# EAGLE design Control HAT v0.2B (EAGLE 9.3.1)

## Sheet 1 of 4: ATmega2560 and Headers
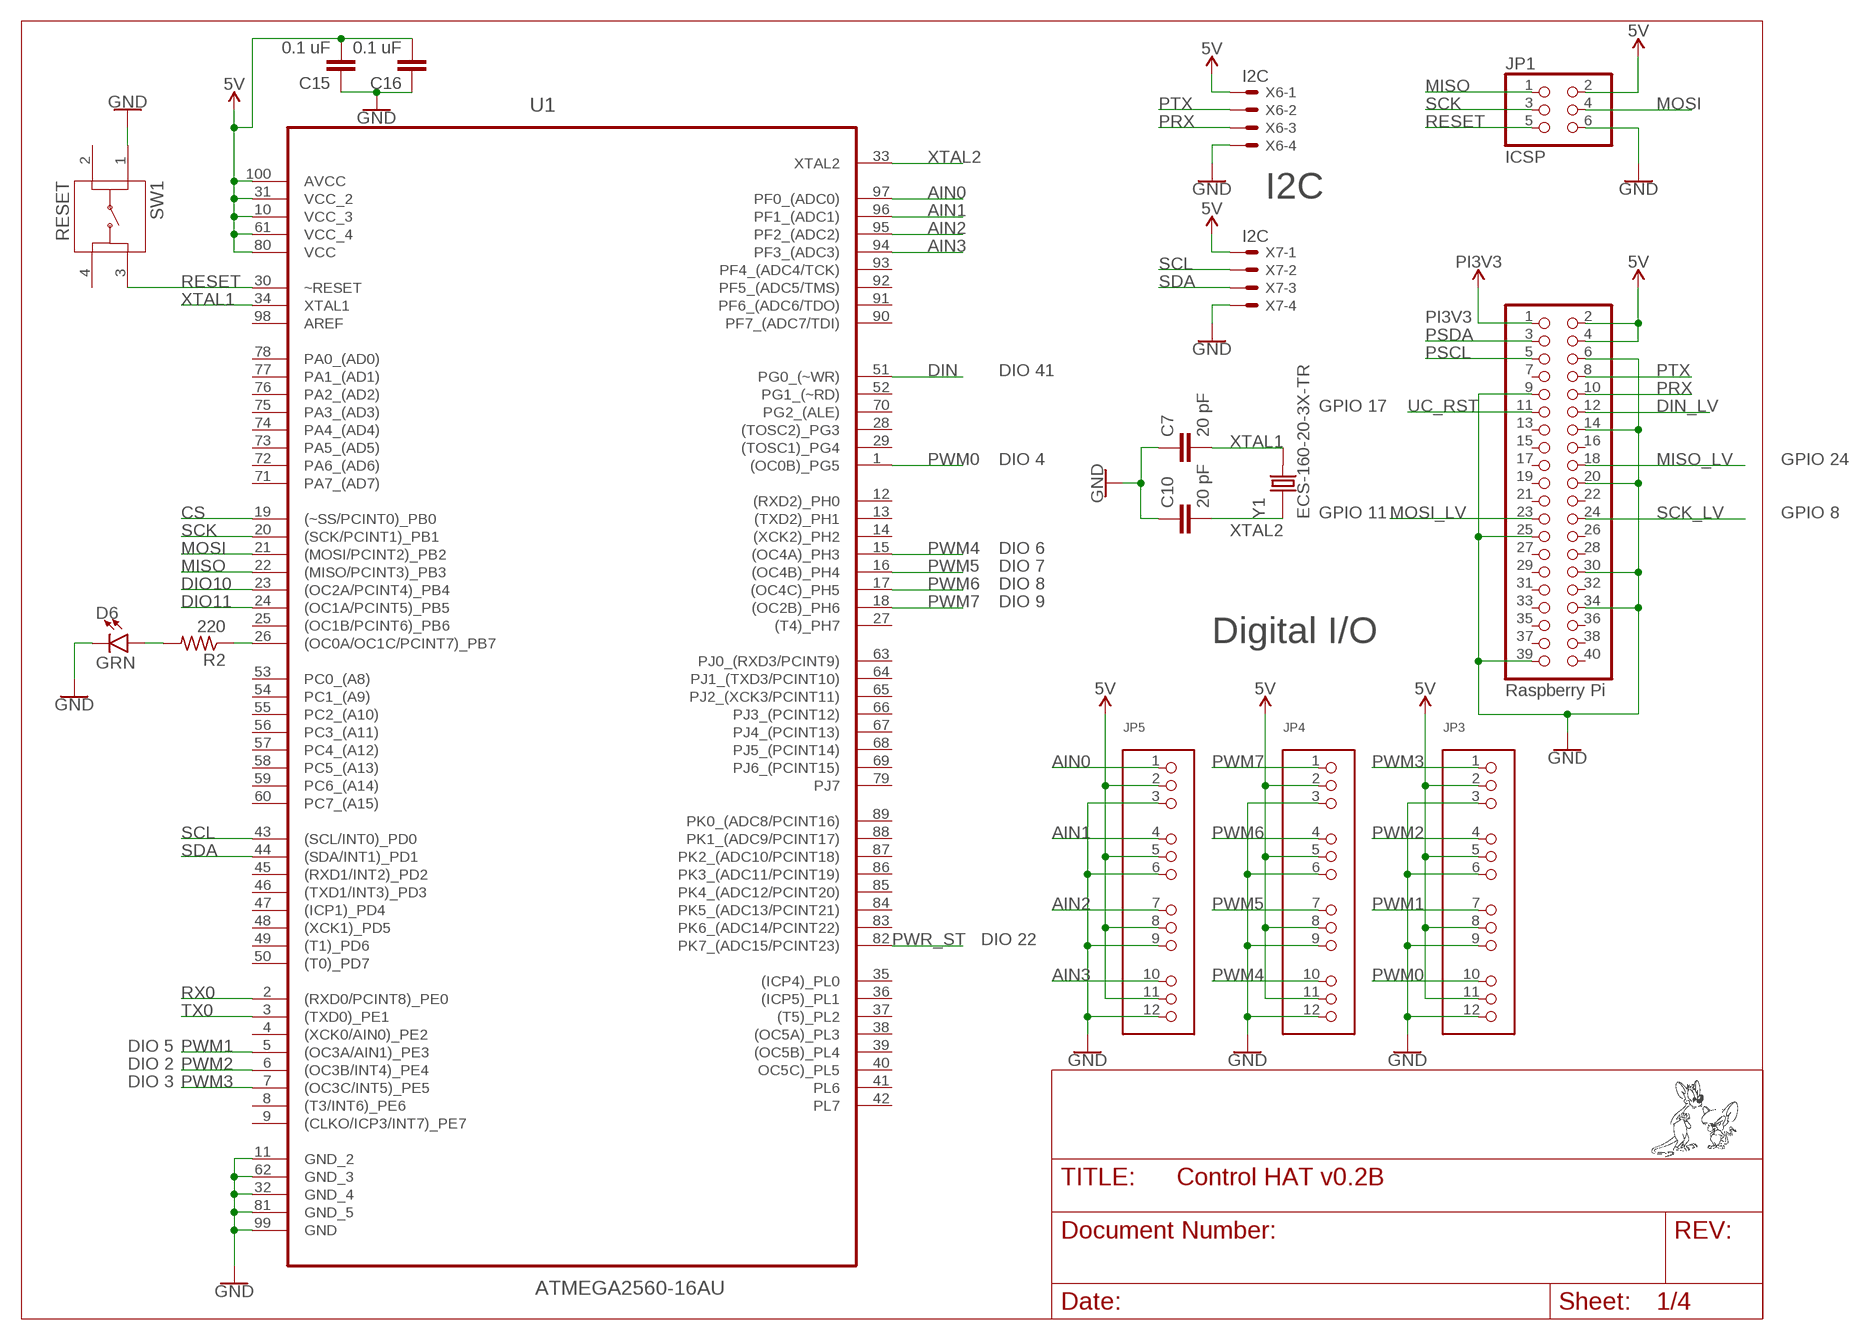
[diagram p0: schematic, sheet 1]

### Parts
C7  20 pF  C-EUC0603  [C0603]
C10  20 pF  C-EUC0603  [C0603]
C15  0.1 uF  C-EUC0603  [C0603]
C16  0.1 uF  C-EUC0603  [C0603]
D6  GRN  LED0603  [LED-0603]
JP1  ICSP  PINHD-2X3  [2X03]
JP2  Raspberry Pi  PINHD-2X20  [2X20]
JP3  HEADER-3X04  [3X04]
JP4  HEADER-3X04  [3X04]
JP5  HEADER-3X04  [3X04]
R2  220  R-US_R0603  [R0603]
SW1  RESET  1825910-6  [SW_1825910-6-4]
U1  ATMEGA2560-16AU  [QFP50P1600X1600X120-100N]
X6  I2C  JST-XH-04-PIN-LONG-PAD  [JST-XH-04-PACKAGE-LONG-PAD]
X7  I2C  JST-XH-04-PIN-LONG-PAD  [JST-XH-04-PACKAGE-LONG-PAD]
Y1  ECS-160-20-3X-TR  [XTAL_ECS-160-20-3X-TR]

### Nets
5V: C15.2 C16.2 JP1.2 JP2.2 JP2.4 JP3.2 JP3.5 JP3.8 JP3.11 JP4.2 JP4.5 JP4.8 JP4.11 JP5.2 JP5.5 JP5.8 JP5.11 U1.10(VCC_3) U1.31(VCC_2) U1.61(VCC_4) U1.80(VCC) U1.100(AVCC) X6.1 X7.1 ; also sheet 2,3,4
AIN0: JP5.1 U1.97(PF0_(ADC0))
AIN1: JP5.4 U1.96(PF1_(ADC1))
AIN2: JP5.7 U1.95(PF2_(ADC2))
AIN3: JP5.10 U1.94(PF3_(ADC3))
CS: U1.19((~SS/PCINT0)_PB0) ; also sheet 4
DIN: U1.51(PG0_(~WR)) ; also sheet 2
DIN_LV: JP2.12 ; also sheet 2
DIO10: U1.23((OC2A/PCINT4)_PB4)
DIO11: U1.24((OC1A/PCINT5)_PB5)
DIO13: R2.1 U1.26((OC0A/OC1C/PCINT7)_PB7)
GND: C7.1 C10.1 C15.1 C16.1 D6.C JP1.6 JP2.6 JP2.9 JP2.14 JP2.20 JP2.25 JP2.30 JP2.34 JP2.39 JP3.3 JP3.6 JP3.9 JP3.12 JP4.3 JP4.6 JP4.9 JP4.12 JP5.3 JP5.6 JP5.9 JP5.12 SW1.1 U1.11(GND_2) U1.32(GND_4) U1.62(GND_3) U1.81(GND_5) U1.99(GND) X6.4 X7.4 ; also sheet 2,3,4
MISO: JP1.1 U1.22((MISO/PCINT3)_PB3) ; also sheet 2,4
MISO_LV: JP2.18 ; also sheet 2
MOSI: JP1.4 U1.21((MOSI/PCINT2)_PB2) ; also sheet 2,4
MOSI_LV: JP2.23 ; also sheet 2
N$12: D6.A R2.2
PI3V3: JP2.1 ; also sheet 2
PRX: JP2.10 X6.3
PSCL: JP2.5 ; also sheet 2
PSDA: JP2.3 ; also sheet 2
PTX: JP2.8 X6.2
PWM0: JP3.10 U1.1((OC0B)_PG5)
PWM1: JP3.7 U1.5((OC3A/AIN1)_PE3)
PWM2: JP3.4 U1.6((OC3B/INT4)_PE4)
PWM3: JP3.1 U1.7((OC3C/INT5)_PE5)
PWM4: JP4.10 U1.15((OC4A)_PH3)
PWM5: JP4.7 U1.16((OC4B)_PH4)
PWM6: JP4.4 U1.17((OC4C)_PH5)
PWM7: JP4.1 U1.18((OC2B)_PH6)
PWR_ST: U1.82(PK7_(ADC15/PCINT23)) ; also sheet 3
RESET: JP1.5 SW1.3 U1.30(~RESET) ; also sheet 2
RX0: U1.2((RXD0/PCINT8)_PE0) ; also sheet 2
SCK: JP1.3 U1.20((SCK/PCINT1)_PB1) ; also sheet 2,4
SCK_LV: JP2.24 ; also sheet 2
SCL: U1.43((SCL/INT0)_PD0) X7.2 ; also sheet 2
SDA: U1.44((SDA/INT1)_PD1) X7.3 ; also sheet 2
TX0: U1.3((TXD0)_PE1) ; also sheet 2
UC_RST: JP2.11 ; also sheet 2
XTAL1: C7.2 U1.34(XTAL1) Y1.2
XTAL2: C10.2 U1.33(XTAL2) Y1.1
Unconnected: JP2.7 JP2.13 JP2.15 JP2.16 JP2.17 JP2.19 JP2.21 JP2.22 JP2.26 JP2.27 JP2.28 JP2.29 JP2.31 JP2.32 JP2.33 JP2.35 JP2.36 JP2.37 JP2.38 JP2.40 SW1.2 SW1.4 U1.4((XCK0/AIN0)_PE2) U1.8((T3/INT6)_PE6) U1.9((CLKO/ICP3/INT7)_PE7) U1.12((RXD2)_PH0) U1.13((TXD2)_PH1) U1.14((XCK2)_PH2) U1.25((OC1B/PCINT6)_PB6) U1.27((T4)_PH7) U1.28((TOSC2)_PG3) U1.29((TOSC1)_PG4) U1.35((ICP4)_PL0) U1.36((ICP5)_PL1) U1.37((T5)_PL2) U1.38((OC5A)_PL3) U1.39((OC5B)_PL4) U1.40(OC5C)_PL5) U1.41(PL6) U1.42(PL7) U1.45((RXD1/INT2)_PD2) U1.46((TXD1/INT3)_PD3) U1.47((ICP1)_PD4) U1.48((XCK1)_PD5) U1.49((T1)_PD6) U1.50((T0)_PD7) U1.52(PG1_(~RD)) U1.53(PC0_(A8)) U1.54(PC1_(A9)) U1.55(PC2_(A10)) U1.56(PC3_(A11)) U1.57(PC4_(A12)) U1.58(PC5_(A13)) U1.59(PC6_(A14)) U1.60(PC7_(A15)) U1.63(PJ0_(RXD3/PCINT9)) U1.64(PJ1_(TXD3/PCINT10)) U1.65(PJ2_(XCK3/PCINT11)) U1.66(PJ3_(PCINT12)) U1.67(PJ4_(PCINT13)) U1.68(PJ5_(PCINT14)) U1.69(PJ6_(PCINT15)) U1.70(PG2_(ALE)) U1.71(PA7_(AD7)) U1.72(PA6_(AD6)) U1.73(PA5_(AD5)) U1.74(PA4_(AD4)) U1.75(PA3_(AD3)) U1.76(PA2_(AD2)) U1.77(PA1_(AD1)) U1.78(PA0_(AD0)) U1.79(PJ7) U1.83(PK6_(ADC14/PCINT22)) U1.84(PK5_(ADC13/PCINT21)) U1.85(PK4_(ADC12/PCINT20)) U1.86(PK3_(ADC11/PCINT19)) U1.87(PK2_(ADC10/PCINT18)) U1.88(PK1_(ADC9/PCINT17)) U1.89(PK0_(ADC8/PCINT16)) U1.90(PF7_(ADC7/TDI)) U1.91(PF6_(ADC6/TDO)) U1.92(PF5_(ADC5/TMS)) U1.93(PF4_(ADC4/TCK)) U1.98(AREF)

### Notes on the sheet
- I2C
- DIO 41
- GPIO 17
- DIO 4 | GPIO 24
- GPIO 11 | GPIO 8
- DIO 6
- DIO 7
- DIO 8
- DIO 9
- Digital I/O
- DIO 22
- DIO 5
- DIO 2
- DIO 3

## Sheet 2 of 4: Logic Level and Serial Converters
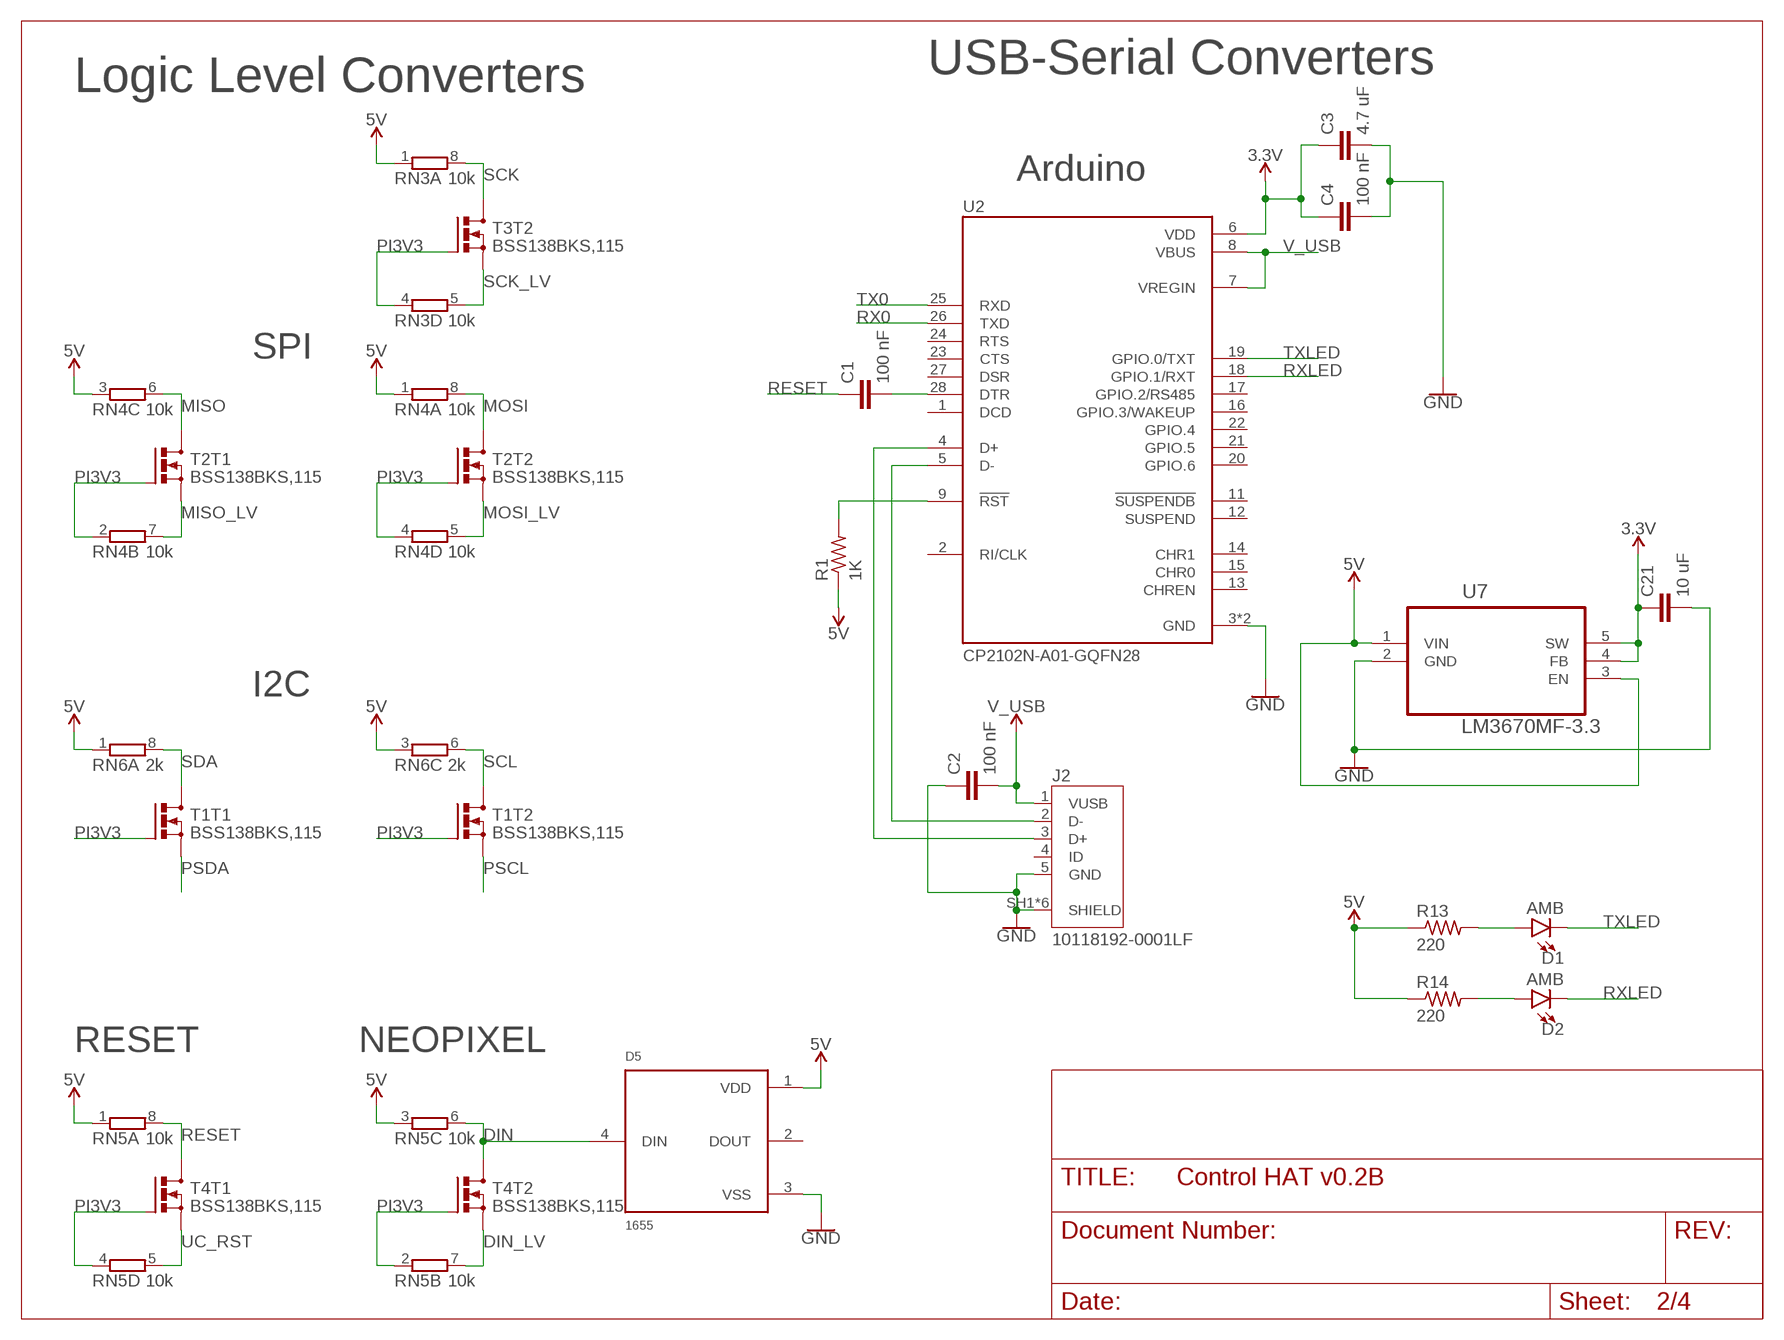
[diagram p1: schematic, sheet 2]

### Parts
C1  100 nF  C-EUC0603  [C0603]
C2  100 nF  C-EUC0603  [C0603]
C3  4.7 uF  C-EUC0603  [C0603]
C4  100 nF  C-EUC0603  [C0603]
C21  10 uF  C-EUC0603  [C0603]
D1  AMB  LED0603  [LED-0603]
D2  AMB  LED0603  [LED-0603]
D5  1655  [FCI_1655]
J2  10118192-0001LF  [AMPHENOL_10118192-0001LF]
R1  1K  R-US_R0603  [R0603]
R13  220  R-US_R0603  [R0603]
R14  220  R-US_R0603  [R0603]
RN3  10k  4R-NEXB28V  [EXB28V]
RN4  10k  4R-NEXB28V  [EXB28V]
RN5  10k  4R-NEXB28V  [EXB28V]
RN6  2k  4R-NEXB28V  [EXB28V]
T1  BSS138BKS,115  [SOT363]
T2  BSS138BKS,115  [SOT363]
T3  BSS138BKS,115  [SOT363]
T4  BSS138BKS,115  [SOT363]
U2  CP2102N-A01-GQFN28  [QFN50P500X500X80-29N]
U7  LM3670MF-3.3  [SOT95P284X122-5N]

### Nets
3.3V: C3.1 C4.1 C21.1 U2.6(VDD) U7.4(FB) U7.5(SW)
5V: D5.1(VDD) R1.1 R13.1 R14.1 RN3.1 RN4.1 RN4.3 RN5.1 RN5.3 RN6.1 RN6.3 U7.1(VIN) U7.3(EN) ; also sheet 1,3,4
DIN: D5.4(DIN) RN5.6 T4.3(T2:D) ; also sheet 1
DIN_LV: RN5.7 T4.4(T2:S) ; also sheet 1
GND: C2.1 C3.2 C4.2 C21.2 D5.3(VSS) J2.5(GND) J2.SH1(SHIELD) J2.SH2(SHIELD) J2.SH3(SHIELD) J2.SH4(SHIELD) J2.SH5(SHIELD) J2.SH6(SHIELD) U2.3(GND) U2.29(GND) U7.2(GND) ; also sheet 1,3,4
MISO: RN4.6 T2.6(T1:D) ; also sheet 1,4
MISO_LV: RN4.7 T2.1(T1:S) ; also sheet 1
MOSI: RN4.8 T2.3(T2:D) ; also sheet 1,4
MOSI_LV: RN4.5 T2.4(T2:S) ; also sheet 1
N$2: J2.2(D-) U2.5(D-)
N$3: J2.3(D+) U2.4(D+)
N$4: R1.2 U2.9(!RST)
N$5: D1.A R13.2
N$6: D2.A R14.2
N$10: C1.2 U2.28(DTR)
PI3V3: RN3.4 RN4.2 RN4.4 RN5.2 RN5.4 T1.2(T1:G) T1.5(T2:G) T2.2(T1:G) T2.5(T2:G) T3.5(T2:G) T4.2(T1:G) T4.5(T2:G) ; also sheet 1
PSCL: T1.4(T2:S) ; also sheet 1
PSDA: T1.1(T1:S) ; also sheet 1
RESET: C1.1 RN5.8 T4.6(T1:D) ; also sheet 1
RX0: U2.26(TXD) ; also sheet 1
RXLED: D2.C U2.18(GPIO.1/RXT)
SCK: RN3.8 T3.3(T2:D) ; also sheet 1,4
SCK_LV: RN3.5 T3.4(T2:S) ; also sheet 1
SCL: RN6.6 T1.3(T2:D) ; also sheet 1
SDA: RN6.8 T1.6(T1:D) ; also sheet 1
TX0: U2.25(RXD) ; also sheet 1
TXLED: D1.C U2.19(GPIO.0/TXT)
UC_RST: RN5.5 T4.1(T1:S) ; also sheet 1
V_USB: C2.2 J2.1(VUSB) U2.7(VREGIN) U2.8(VBUS)
Unconnected: D5.2(DOUT) J2.4(ID) RN3.2 RN3.3 RN3.6 RN3.7 RN6.2 RN6.4 RN6.5 RN6.7 T3.1(T1:S) T3.2(T1:G) T3.6(T1:D) U2.1(DCD) U2.2(RI/CLK) U2.11(!SUSPENDB) U2.12(SUSPEND) U2.13(CHREN) U2.14(CHR1) U2.15(CHR0) U2.16(GPIO.3/WAKEUP) U2.17(GPIO.2/RS485) U2.20(GPIO.6) U2.21(GPIO.5) U2.22(GPIO.4) U2.23(CTS) U2.24(RTS) U2.27(DSR)

### Notes on the sheet
- USB-Serial Converters
- Logic Level Converters
- Arduino
- SPI
- I2C
- RESET | NEOPIXEL

## Sheet 3 of 4: Power Management
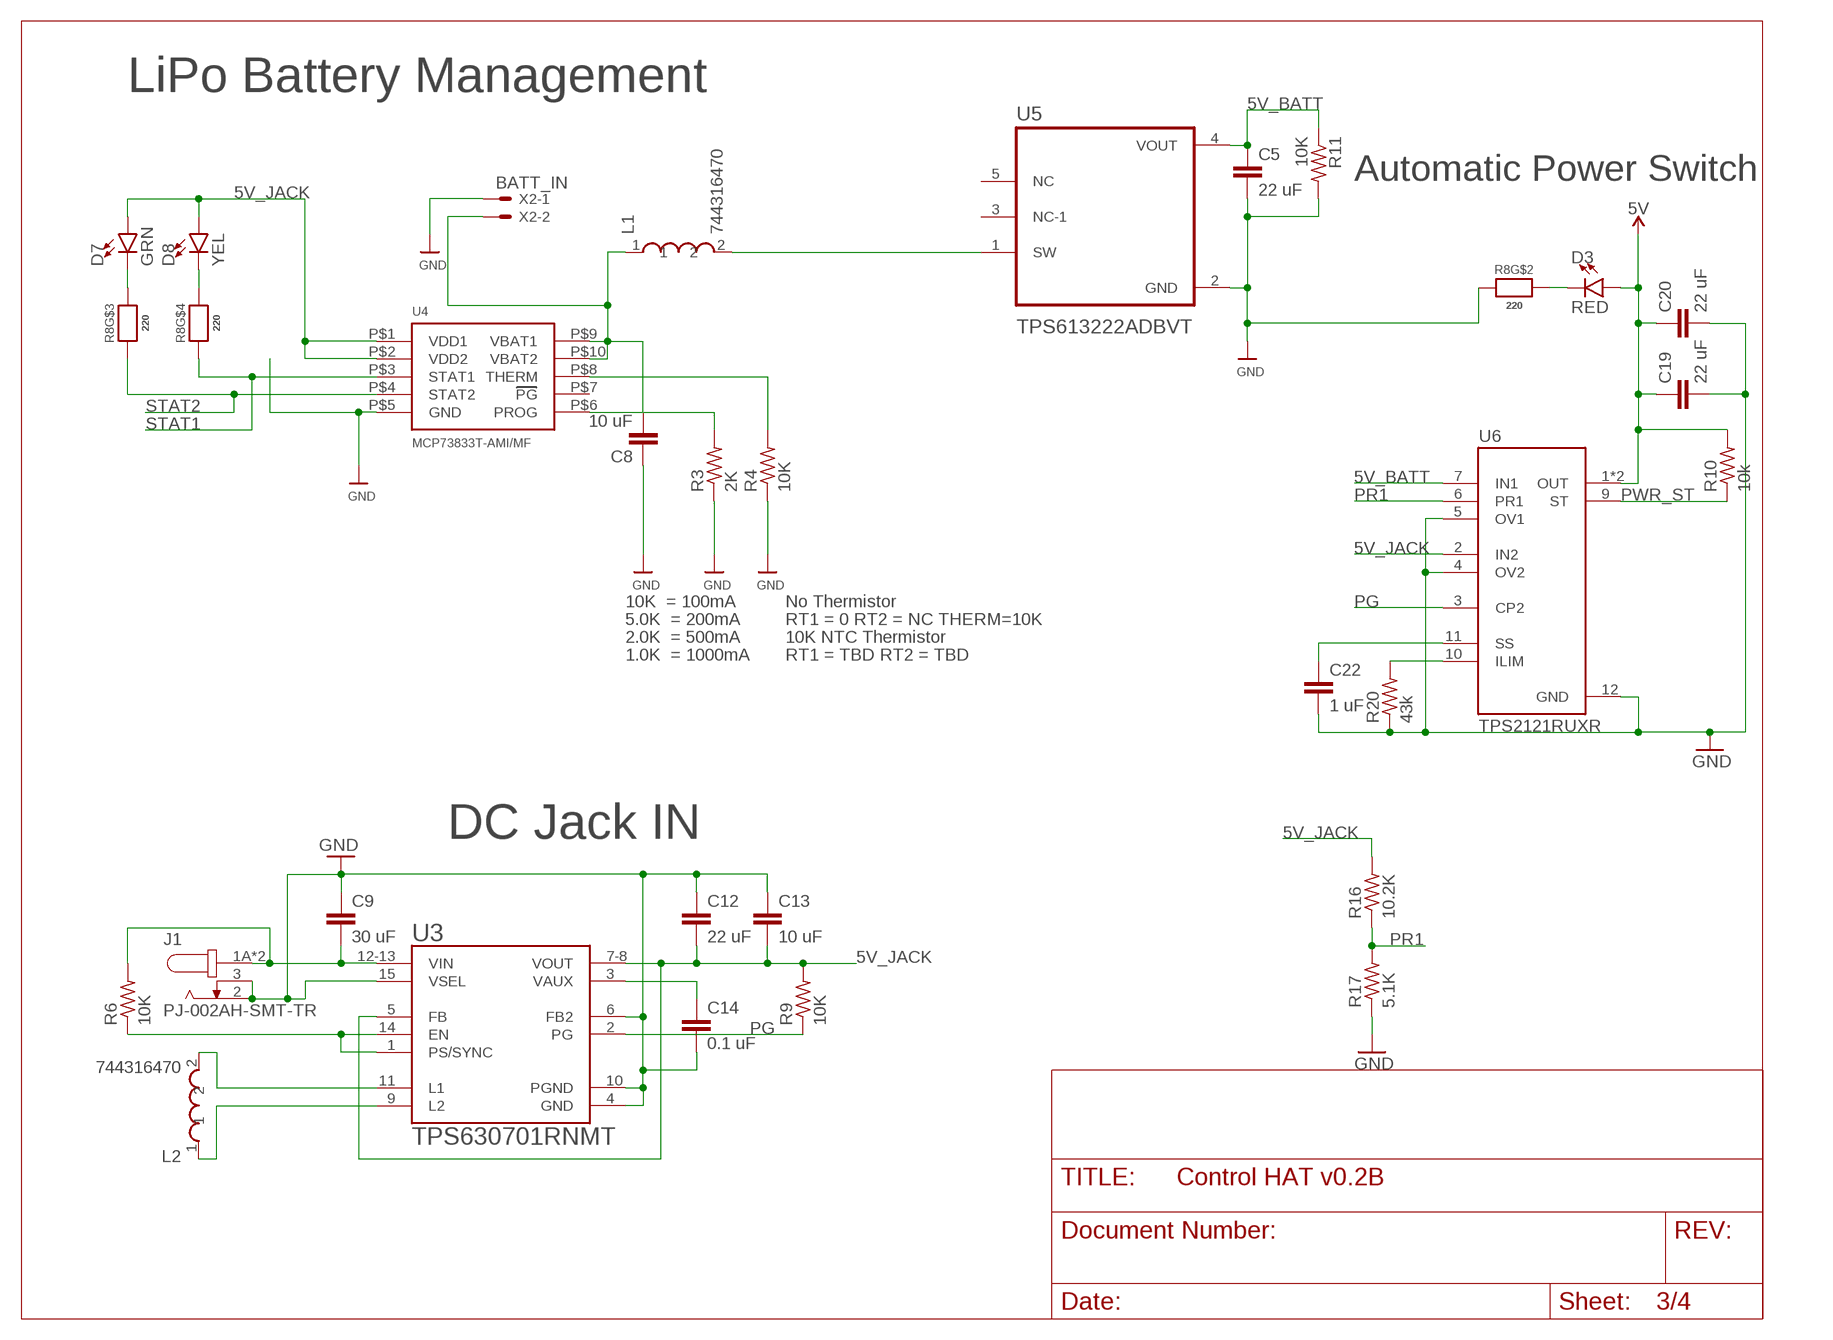
[diagram p2: schematic, sheet 3]

### Parts
C5  22 uF  C-EUC0603  [C0603]
C8  10 uF  C-EUC0603  [C0603]
C9  30 uF  C-EUC0603  [C0603]
C12  22 uF  C-EUC0603  [C0603]
C13  10 uF  C-EUC0603  [C0603]
C14  0.1 uF  C-EUC0603  [C0603]
C19  22 uF  C-EUC0603  [C0603]
C20  22 uF  C-EUC0603  [C0603]
C22  1 uF  C-EUC0603  [C0603]
D3  RED  LED0603  [LED-0603]
D7  GRN  LED0603  [LED-0603]
D8  YEL  LED0603  [LED-0603]
J1  PJ-002AH-SMT-TR  [CUI_PJ-002AH-SMT-TR]
L1  744316470  [INDC2220X16]
L2  744316470  [INDC2220X16]
R3  2K  R-US_R0603  [R0603]
R4  10K  R-US_R0603  [R0603]
R6  10K  R-US_R0603  [R0603]
R8  220  RESISTOR_4PACK  [RESPACK_4X0603]
R9  10K  R-US_R0603  [R0603]
R10  10k  R-US_R0603  [R0603]
R11  10K  R-US_R0603  [R0603]
R16  10.2K  R-US_R0603  [R0603]
R17  5.1K  R-US_R0603  [R0603]
R20  43k  R-US_R0603  [R0603]
U3  TPS630701RNMT  TPS63070RNMT  [QFN50P250X300X100-15N]
U4  MCP73833T-AMI/MF  MCP73833DFN  [DFN10_3X3MM]
U5  TPS613222ADBVT  [SOT95P280X145-5N]
U6  TPS2121RUXR  [IC_TPS2121RUXR]
X2  BATT_IN  JST-XH-02-PIN-LONG-PAD  [JST-XH-02-PACKAGE-LONG-PAD]

### Nets
5V: C19.1 C20.1 D3.A R10.2 U6.1(OUT) U6.8(OUT) ; also sheet 1,2,4
5V_BATT: C5.1 R11.1 U5.4(VOUT) U6.7(IN1)
5V_JACK: C12.2 C13.2 D7.A D8.A R9.2 R16.2 U3.5(FB) U3.7-8(VOUT) U4.P$1(VDD1) U4.P$2(VDD2) U6.2(IN2)
BATT: C8.2 L1.1 U4.P$9(VBAT1) U4.P$10(VBAT2) X2.2
GND: C5.2 C8.1 C9.1 C12.1 C13.1 C14.2 C19.2 C20.2 C22.2 J1.2 J1.3 R3.1 R4.1 R8.2 R11.2 R17.1 R20.1 U3.4(GND) U3.6(FB2) U3.10(PGND) U3.15(VSEL) U4.P$5(GND) U5.2(GND) U6.4(OV2) U6.5(OV1) U6.12(GND) X2.1 ; also sheet 1,2,4
N$1: D7.C R8.6
N$7: C9.2 J1.1A J1.1B R6.2 U3.12-13(VIN)
N$8: D8.C R8.5
N$11: D3.C R8.7
N$13: L2.2 U3.11(L1)
N$14: L2.1 U3.9(L2)
N$15: C14.1 U3.3(VAUX)
N$16: L1.2 U5.1(SW)
N$19: R3.2 U4.P$6(PROG)
N$20: R6.1 U3.1(PS/SYNC) U3.14(EN)
N$21: R4.2 U4.P$8(THERM)
N$38: R20.2 U6.10(ILIM)
N$39: C22.1 U6.11(SS)
PG: R9.1 U3.2(PG) U6.3(CP2)
PR1: R16.1 R17.2 U6.6(PR1)
PWR_ST: R10.1 U6.9(ST) ; also sheet 1
STAT1: R8.4 U4.P$3(STAT1)
STAT2: R8.3 U4.P$4(STAT2)
Unconnected: R8.1 R8.8 U4.P$7(PG) U5.3(NC-1) U5.5(NC)

### Notes on the sheet
- LiPo Battery Management
- Automatic Power Switch
- 10K  = 100mA | No Thermistor
- 5.0K  = 200mA | RT1 = 0 RT2 = NC THERM=10K
- 2.0K  = 500mA | 10K NTC Thermistor
- 1.0K  = 1000mA | RT1 = TBD RT2 = TBD
- DC Jack IN

## Sheet 4 of 4: CAN Bus Interface
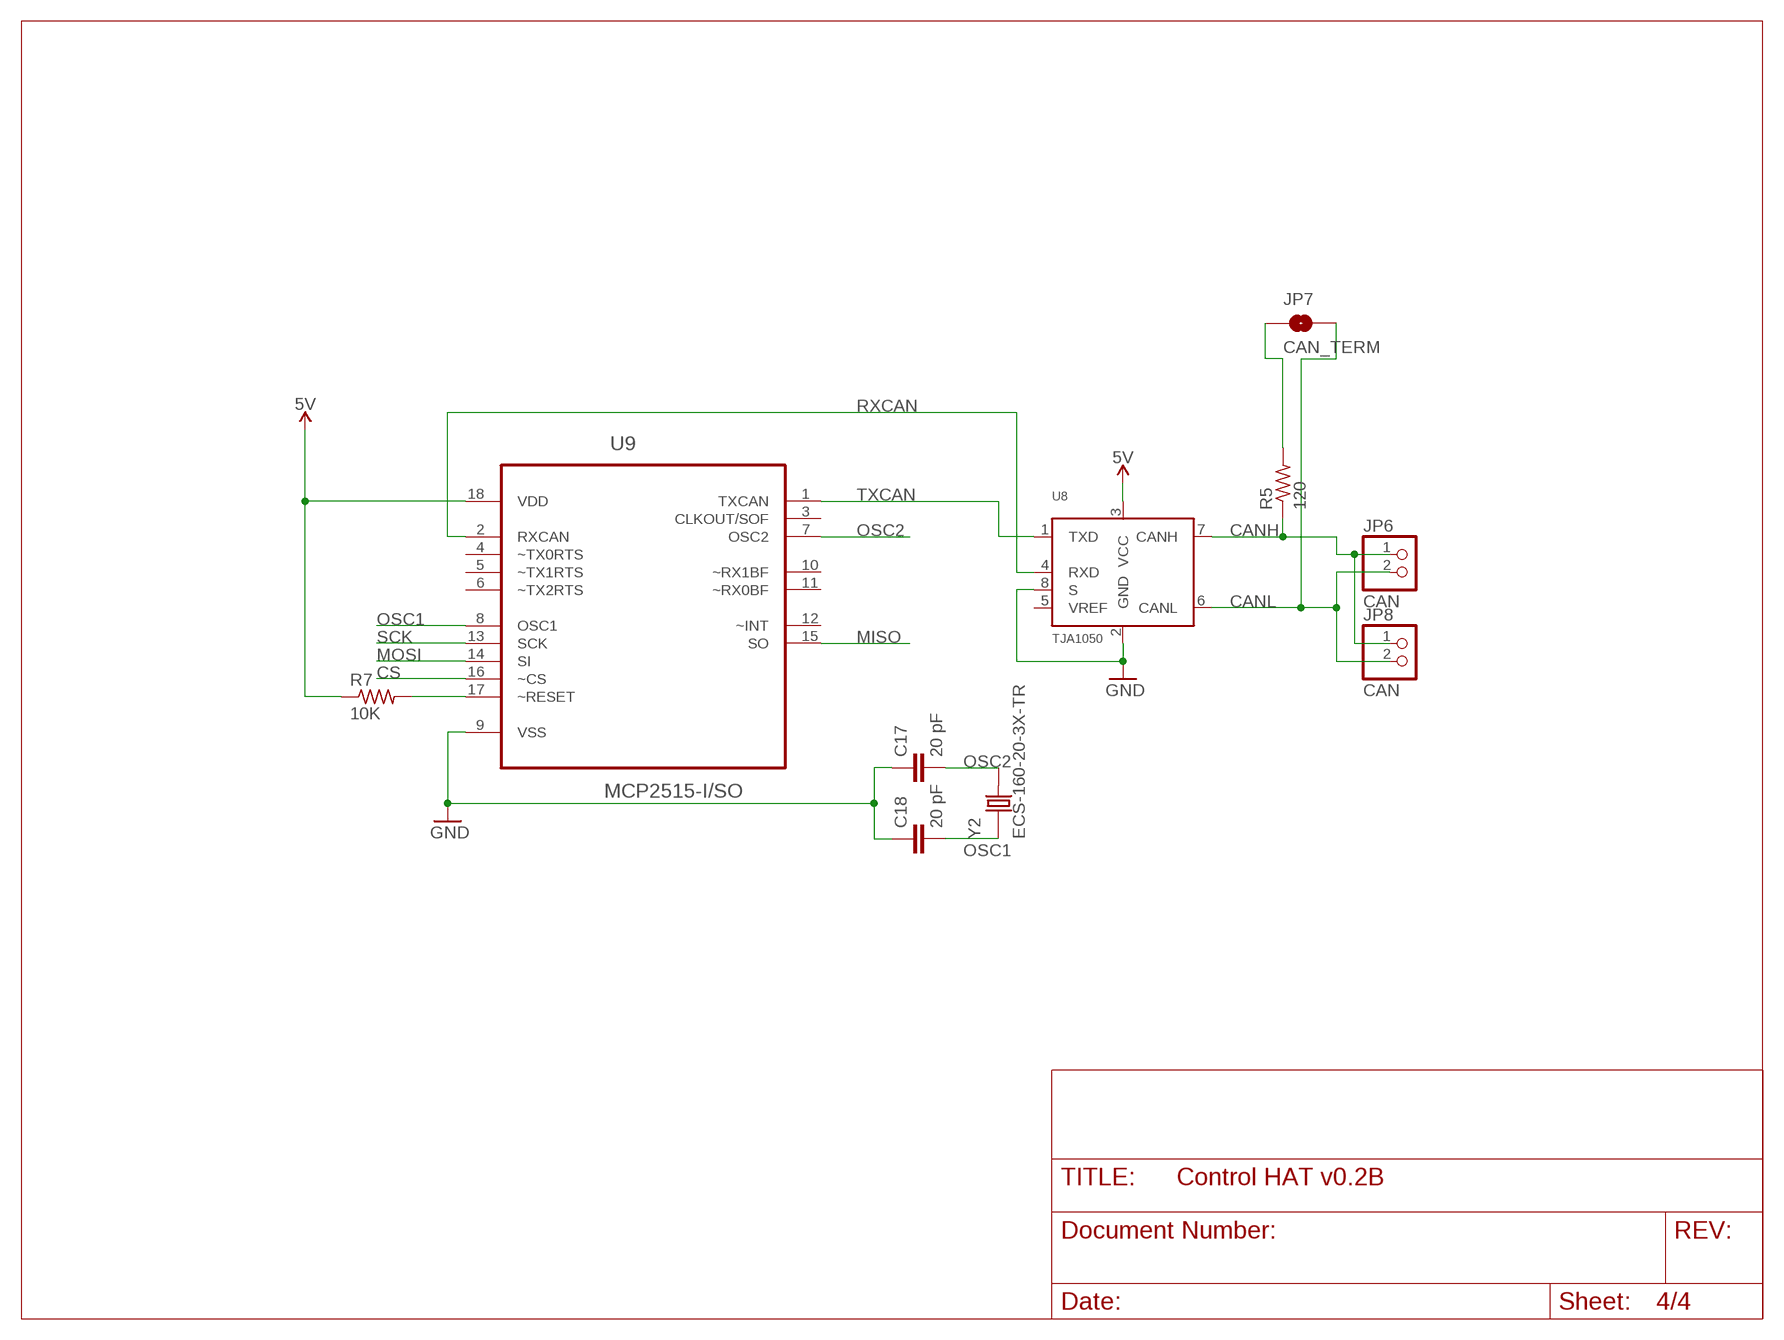
[diagram p3: schematic, sheet 4]

### Parts
C17  20 pF  C-EUC0603  [C0603]
C18  20 pF  C-EUC0603  [C0603]
JP6  CAN  PINHD-1X2  [1X02]
JP7  CAN_TERM  JUMPER-SMT_2_NO_NO-SILK  [SMT-JUMPER_2_NO_NO-SILK]
JP8  CAN  PINHD-1X2  [1X02]
R5  120  R-US_R0603  [R0603]
R7  10K  R-US_R0603  [R0603]
U8  TJA1050  [SOT96-1]
U9  MCP2515-I/SO  [SOIC127P1034X264-18N]
Y2  ECS-160-20-3X-TR  [XTAL_ECS-160-20-3X-TR]

### Nets
5V: R7.1 U8.3(VCC) U9.18(VDD) ; also sheet 1,2,3
CANH: JP6.1 JP8.1 R5.1 U8.7(CANH)
CANL: JP6.2 JP7.2 JP8.2 U8.6(CANL)
CS: U9.16(~CS) ; also sheet 1
GND: C17.1 C18.1 U8.2(GND) U8.8(S) U9.9(VSS) ; also sheet 1,2,3
MISO: U9.15(SO) ; also sheet 1,2
MOSI: U9.14(SI) ; also sheet 1,2
N$26: JP7.1 R5.2
N$27: R7.2 U9.17(~RESET)
OSC1: C18.2 U9.8(OSC1) Y2.1
OSC2: C17.2 U9.7(OSC2) Y2.2
RXCAN: U8.4(RXD) U9.2(RXCAN)
SCK: U9.13(SCK) ; also sheet 1,2
TXCAN: U8.1(TXD) U9.1(TXCAN)
Unconnected: U8.5(VREF) U9.3(CLKOUT/SOF) U9.4(~TX0RTS) U9.5(~TX1RTS) U9.6(~TX2RTS) U9.10(~RX1BF) U9.11(~RX0BF) U9.12(~INT)

## Library data of the parts
C1-C5 C7-C10 C12-C22 = rcl:C-EU: CAPACITOR, European symbol; SPICEPREFIX: C
D1-D3 D6-D8 = SparkFun-LED:LED: LED (Generic) Standard schematic elements and footprints for 5mm, 3mm, 1206, and 0603 sized LEDs. Generic LEDs with no color specified.
D5 = Neopixel-1655:1655: Ws2812b 5050 Rgb Led With Integrated Driver Chip Pack Of 10; AVAILABILITY: Unavailable; DESCRIPTION: US Flag 10x15 feet Nylon; MF: Adafruit Industries; MP: 1655; PACKAGE: Nyl-Glo; PRICE: None
J1 = PJ-002AH-SMT-TR:PJ-002AH-SMT-TR: 2.0 mm Center Pin, 5.0 A, Right Angle, Surface Mount (SMT), Dc Power Jack Connector; CUI_PURCHASE_URL: https://www.cui.com/product/interconnect/dc-power-connectors/jacks/2.0-mm-center-pin/pj-002ah-smt-tr?utm_source=snapeda.com&utm_medium=referral&utm_campaign=snapedaBOM; DESCRIPTION: 24 VDC 5 A Surface Mount Unshielded 2 Conductors 3 Contacts Male Power Jack; DIGI-KEY_PART_NUMBER: CP-002AHPJCT-ND; DIGI-KEY_PURCHASE_URL: https://www.digikey.com/product-detail/en/cui-inc/PJ-002AH-SMT-TR/CP-002AHPJCT-ND/669692?utm_source=snapeda&utm_medium=aggregator&utm_campaign=symbol; MF: CUI Inc.; MP: PJ-002AH-SMT-TR; PACKAGE: None
J2 = 10118192-0001LF:10118192-0001LF: Single Port 5 Contact Horizontal Right Angle Shielded Micro B USB 2.0 Connector; AVAILABILITY: Unavailable; DESCRIPTION: Single Port 5 Contact Horizontal Right Angle Shielded Micro B USB 2.0 Connector; MF: Amphenol ICC; MP: 10118192-0001LF; PACKAGE: None; PRICE: None
JP1 = pinhead:PINHD-2X3: PIN HEADER
JP2 = pinhead:PINHD-2X20: PIN HEADER
JP3-JP5 = microbuilder:HEADER-3X04
JP6 JP8 = pinhead:PINHD-1X2: PIN HEADER
JP7 = SparkFun-Jumpers:JUMPER-SMT_2_NO: Normally open jumper This jumper has two pads in close proximity to each other. Apply solder to close the connection. Round pads are easier to solder for beginners, but are a lot larger. SparkFun Product that uses the round pads: SparkFun EL Sequencer <https://www.sparkfun.com/products/12781>
L1 L2 = 744316470:744316470: Surface Mount Power Inductor, WE-HCI Series, 4.7 H, 20%, Shielded, 0.0245 ohm, 4.6 A; AVAILABILITY: Unavailable; DESCRIPTION: Surface Mount Power Inductor, WE-HCI Series, 4.7 H, 20%, Shielded, 0.0245 ohm, 4.6 A; MF: Wurth Electronics; MP: 744316470; PACKAGE: SMD-2 Würth Elektronik; PRICE: None
R1-R7 R9-R11 R13 R14 R16 R17 R20 = rcl:R-US_: RESISTOR, American symbol; SPICEPREFIX: R
R8 = microbuilder:RESISTOR_4PACK: Resistor Packs (4 resistors) 4 x 0603 10K 1/16W - Digikey: YC164J-10KCT-ND
RN3-RN6 = resistor-dil:4R-N: Array Chip Resistor Source: RS Component / Phycomp; OC_FARNELL: unknown; OC_NEWARK: unknown
SW1 = Tactile Switch:1825910-6: Switch Tactile OFF (ON) SPST Round Button PC Pins 0.05A 24VDC 100000Cycles 1.57N Thru-Hole Loose; AVAILABILITY: Unavailable; COMMENT: 1825910-6; CONFIGURATION_POLE-THROW: Single Pole - Single Throw; CONTACT_CURRENT_RATING: 50 mA; DESCRIPTION: FSM4JH=6MM TACT SWITCH, HIGH TEMP; EU_ROHS_COMPLIANCE: Compliant; MF: TE Connectivity; MP: 1825910-6; PACKAGE: None; PRICE: None; TE_PURCHASE_URL: https://www.te.com/usa-en/product-1825910-6.html?te_bu=Cor&te_type=disp&te_campaign=seda_glo_cor-seda-global-disp-prtnr-fy19-seda-model-bom-cta_sma-317_1&elqCampaignId=32493
T1-T4 = BSS138BKS_115:BSS138BKS,115; AVAILABILITY: Unavailable; DESCRIPTION: Dual N-Channel 60 V 1.6 Ohm 445 mW 0.6 nC Surface Mount Trench MOSFET - TSSOP-6; MF: Nexperia USA; MP: BSS138BKS,115; PACKAGE: SOT-363 Nexperia; PRICE: None
U1 = ATMEGA2560-16AU:ATMEGA2560-16AU: Microcontroller; AVAILABILITY: Unavailable; DESCRIPTION: Embedded microcontroller ATMEGA2560-16AU TQFP 100 _14x14_ Microchip Technology 8-Bit 16 MHz I/O number 86; MF: Microchip; MP: ATMEGA2560-16AU; PACKAGE: TQFP-100 Microchip; PRICE: None
U2 = CP2102N-A01-GQFN28:CP2102N-A01-GQFN28: Ic Bridge Usb To Uart 28qfn; AVAILABILITY: Unavailable; DESCRIPTION: Usb-Uart Interface Bridge, Qfn-28; MF: Silicon Labs; MP: CP2102N-A01-GQFN28; PACKAGE: QFN-28 Silicon Labs; PRICE: None
U3 = TPS63070RNMT:TPS63070RNMT: Wide Input Voltage (2V-16V) Buck-Boost Converter 15-VQFN-HR; AVAILABILITY: Unavailable; DESCRIPTION: Conv DC-DC 2V to 16V Step Down/Step Up Single-Out 2.5V to 9V 2A 15-Pin VQFN-HR T/R; MF: Texas Instruments; MP: TPS63070RNMT; PACKAGE: VQFN-15 Texas Instruments; PRICE: None
U4 = microbuilder:MCP73833: Lithium-Polymer/Lithium-Ion Battery Charger [Part No.] Microchip MCP73833 MSOP10 (tube only): Digikey: MCP73833T-AMI/UN or MCP73833-FCI/UN-ND Mouser: 579-MCP73833-AMI/UN DFN10 (tape): Digikey: Note Chips ending in 'AMI' have no timer, and chips ending in 'FCI' have a 6-hour timer that will end the charge sequence after 6 horus regqrdless of current charge level.
U5 = TPS613222ADBVT:TPS613222ADBVT: None; AVAILABILITY: Unavailable; DESCRIPTION: 6-uA Quiescent Current, 1.8-A Switch Current Boost Converter 5-SOT-23 -40 to 85; MF: Texas Instruments; MP: TPS613222ADBVT; PACKAGE: SOT-23 Texas Instruments; PRICE: None
U6 = TPS2121RUXR:TPS2121RUXR: PWR MGMT BATTERY MGMT; AVAILABILITY: Unavailable; DESCRIPTION: PWR MGMT BATTERY MGMT; MF: Texas Instruments; MP: TPS2121RUXR; PACKAGE: VFQFN-12 Texas Instruments; PRICE: None
U7 = LM3670MF-3.3:LM3670MF-3.3: IC BUCK 3.3V 350MA; AVAILABILITY: Unavailable; DESCRIPTION: Miniature Step-Down DC-DC Converter for Ultra Low Voltage Circuits 5-SOT-23 -40 to 85; MF: Texas Instruments; MP: LM3670MF-3.3/NOPB; PACKAGE: SOT-23 Texas Instruments; PRICE: None
U8 = TJA1050:TJA1050: High speed CAN transceiver The TJA1050 is the interface between the Controller Area Network (CAN) protocol controller and the physical bus. The device provides differential transmit capability to the bus and differential receive capability to the CAN controller. The TJA1050 is the third Philips high-speed CAN transceiver after the PCA82C250 and the PCA82C251. The most important differences are: Much lower electromagnetic emission due to optimal matching of the output signals CANH and CANL Improved behaviour in case of an unpowered node No standby mode. This makes the TJA1050 eminently suitable for use in nodes that are in a power-down situation in partially powered networks. AAL Eindhoven MK; DIGI-KEY_PART_NUMBER: 568-10292-1-ND; DIGI-KEY_PURCHASE_URL: https://www.digikey.com/product-detail/en/nxp-usa-inc/TJA1050T-CM,118/568-10292-1-ND/4162437?utm_source=snapeda&utm_medium=aggregator&utm_campaign=symbol; MF: NXP USA; MP: TJA1050; PACKAGE: SOIC-8 NXP USA
U9 = MCP2515-I_SO:MCP2515-I/SO: CAN Controller; DESCRIPTION: MCP2515 Series 5.5 V 1 Mb/s Stand Alone SPI Interface CAN Controller- SOIC-18; DIGI-KEY_PART_NUMBER: MCP2515-I/SO-ND; DIGI-KEY_PURCHASE_URL: https://www.digikey.com/product-detail/en/microchip-technology/MCP2515-I-SO/MCP2515-I-SO-ND/593001?utm_source=snapeda&utm_medium=aggregator&utm_campaign=symbol; MF: Microchip; MP: MCP2515-I/SO; PACKAGE: SOIC-18 Microchip
X2 = Rembrandt Electronics - JST XH Connectors v1-0:JST-XH-02-PIN: JST XH Connector 2 Pin Wire to board connector. Pitch: 2,54 mm, (0.100") Number of pins: 2 Created by Rembrandt Electronics www.rembrandtelectronics.com
X6 X7 = Rembrandt Electronics - JST XH Connectors v1-0:JST-XH-04-PIN: JST XH Connector 2 Pin Wire to board connector. Pitch: 2,54 mm, (0.100") Number of pins: 4 Created by Rembrandt Electronics www.rembrandtelectronics.com
Y1 Y2 = ECS-160-20-3X-TR:ECS-160-20-3X-TR: SMD QUARTZ CRYSTAL; AVAILABILITY: Unavailable; DESCRIPTION: CSM-3X Series 16 MHz ±30 ppm 20 pF -10 to +70 °C Surface Mount Quartz Crystal; MF: ECS Inc.; MP: ECS-160-20-3X-TR; PACKAGE: HC49/US ECS International; PRICE: None

## Board
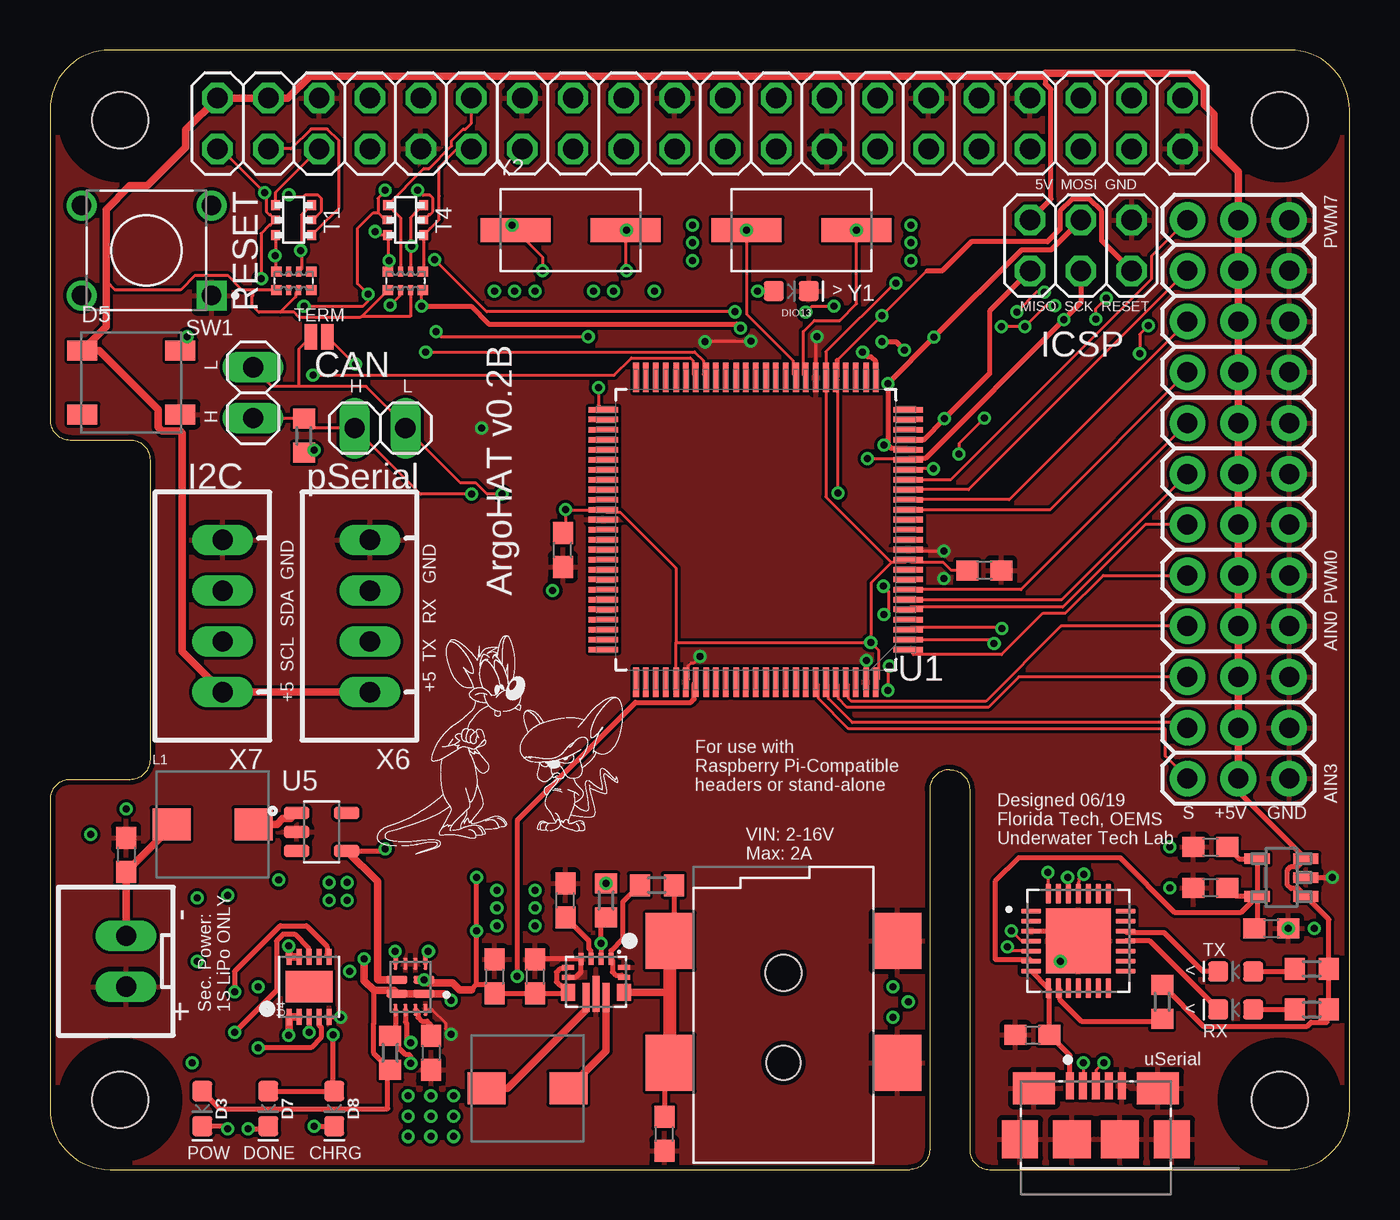
[diagram p4: board, top side]
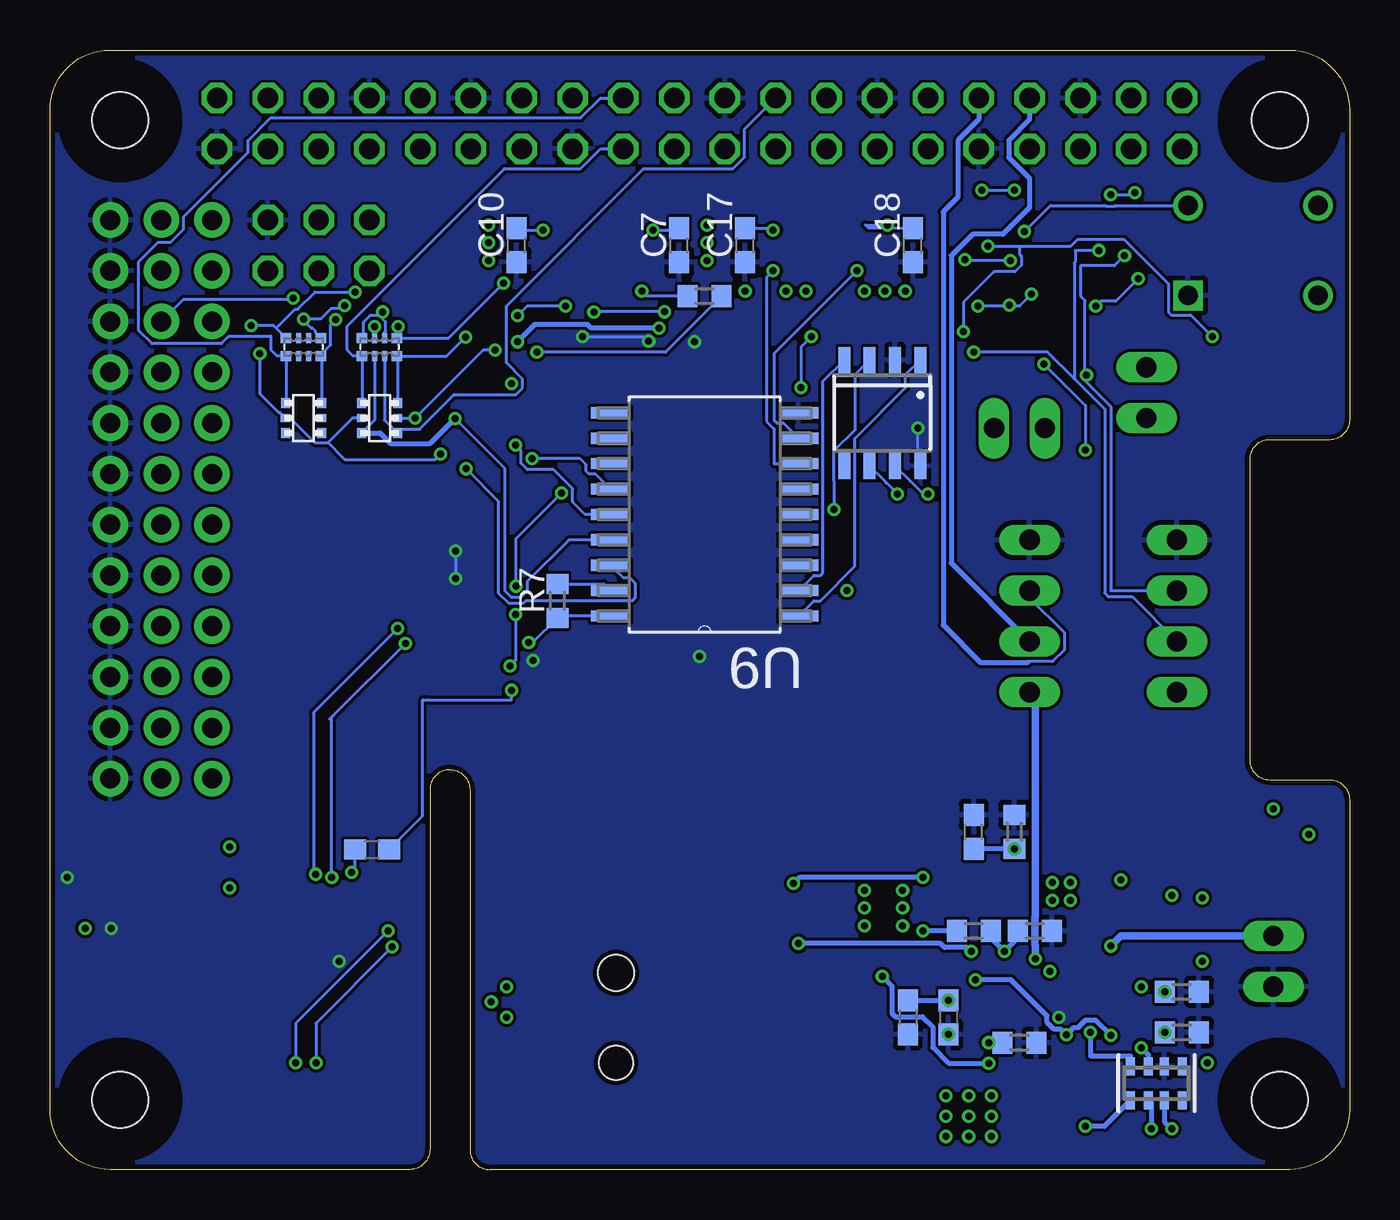
[diagram p5: board, bottom side, seen from below]

Size 65 x 56 mm. Coordinates in mm from the lower left corner, seen from the top.
Outline: 0,3 arc90 3,0 43,0 arc90 44,1 44,19 arc-90 45,20 arc-90 46,19 46,1 arc90 47,0 62,0 arc90 65,3 65,53 arc90 62,56 3,56 arc90 0,53 0,37.5 arc90 1,36.5 4,36.5 arc-90 5,35.5 5,20.5 arc-90 4,19.5 1,19.5 arc90 0,18.5 0,3
Copper layers (1*16): Top 0.035mm / dielectric 1.5mm / Bottom 0.035mm
Design rules "ITEADstudio_DRC": minimum track width 6mil, minimum drill 12mil, track to track 6mil, track to pad 6mil, pad to pad 6mil, via to via 6mil, smd to smd 0mil, copper to edge 10mil, drill to drill 10mil, minimum pad ring 10mil, minimum via ring 6mil, stop-mask expansion 2mil, vias tented up to drill 100mil, thermal gap 10mil
Holes 2.8 mm at 3.5,3.5 3.5,52.5 61.5,52.5 61.5,3.5
tRestrict: area 1.9,51 to 5,54; area 60,51 to 63,54; area 60,1.9 to 63,5; area 1.9,1.9 to 5,5
bRestrict: area 1.9,1.9 to 5,5; area 1.9,51 to 5,54; area 60,1.9 to 63,5; area 60,51 to 63,54

### Footprints (pad centres in the part's own frame; a part is rotated, then mirrored left to right if it is on the bottom)
C0603 = smd 1.1 x 1: 1 -0.85,0; 2 0.85,0
LED-0603 = smd 1 x 1: A -0.877,0; C 0.877,0
FCI_1655 = smd 1.5 x 1: 1 -2.45,1.6; 2 -2.45,-1.6; 3 2.45,-1.6; 4 2.45,1.6
CUI_PJ-002AH-SMT-TR = smd 2.8 x 2.4: 1A 0,0; 1B -6.1,0; 2 -6.1,-11.4; 3 0,-11.4 | hole 1.7: -6.1,-5.7 | hole 1.8: -1.6,-5.7
AMPHENOL_10118192-0001LF = smd 0.4 x 1.35: 1 -1.3,0; 2 -0.65,0; 3 0,0; 4 0.65,0; 5 1.3,0 | smd 2.1 x 1.6: SH1 -3.1,-0.125; SH2 3.1,-0.125 | smd 1.8 x 1.9: SH3 -3.8,-2.675; SH6 3.8,-2.675 | smd 1.9 x 1.9: SH4 -1.2,-2.675; SH5 1.2,-2.675
2X03 = drill 1.016 octagon: 1 -2.54,-1.27; 2 -2.54,1.27; 3 0,-1.27; 4 0,1.27; 5 2.54,-1.27; 6 2.54,1.27
2X20 = drill 1.016 octagon: 1 -24.13,-1.27; 2 -24.13,1.27; 3 -21.59,-1.27; 4 -21.59,1.27; 5 -19.05,-1.27; 6 -19.05,1.27; 7 -16.51,-1.27; 8 -16.51,1.27; 9 -13.97,-1.27; 10 -13.97,1.27; 11 -11.43,-1.27; 12 -11.43,1.27; 13 -8.89,-1.27; 14 -8.89,1.27; 15 -6.35,-1.27; 16 -6.35,1.27; 17 -3.81,-1.27; 18 -3.81,1.27; 19 -1.27,-1.27; 20 -1.27,1.27; 21 1.27,-1.27; 22 1.27,1.27; 23 3.81,-1.27; 24 3.81,1.27; 25 6.35,-1.27; 26 6.35,1.27; 27 8.89,-1.27; 28 8.89,1.27; 29 11.43,-1.27; 30 11.43,1.27; 31 13.97,-1.27; 32 13.97,1.27; 33 16.51,-1.27; 34 16.51,1.27; 35 19.05,-1.27; 36 19.05,1.27; 37 21.59,-1.27; 38 21.59,1.27; 39 24.13,-1.27; 40 24.13,1.27
3X04 = drill 1 pad 1.778: 1 -3.81,-2.54; 2 -3.81,0; 3 -3.81,2.54; 4 -1.27,-2.54; 5 -1.27,0; 6 -1.27,2.54; 7 1.27,-2.54; 8 1.27,0; 9 1.27,2.54; 10 3.81,-2.54; 11 3.81,0; 12 3.81,2.54
1X02 = drill 1.016 long: 1 -1.27,0; 2 1.27,0
SMT-JUMPER_2_NO_NO-SILK = smd 0.635 x 1.27: 1 -0.406,0; 2 0.406,0
INDC2220X16 = smd 1.9 x 1.6: 1 -2.05,0; 2 2.05,0
R0603 = smd 1 x 1.1: 1 -0.85,0; 2 0.85,0
RESPACK_4X0603 = smd 0.45 x 0.9: 1 -1.3,-0.85; 2 -0.4,-0.85; 3 0.4,-0.85; 4 1.3,-0.85; 5 1.3,0.85; 6 0.4,0.85; 7 -0.4,0.85; 8 -1.3,0.85
EXB28V = smd 0.525 x 0.5: 1 -0.875,-0.45; 4 0.875,-0.45; 5 0.875,0.45; 8 -0.875,0.45 | smd 0.25 x 0.5: 2 -0.25,-0.45; 3 0.25,-0.45; 6 0.25,0.45; 7 -0.25,0.45
SW_1825910-6-4 = drill 0.99 square: 1 -3.25,2.25 | drill 0.99: 2 3.25,2.25; 3 -3.25,-2.25; 4 3.25,-2.25
SOT363 = smd 0.5 x 0.5: 1 -0.9,0.75; 3 -0.9,-0.75; 4 0.9,-0.75; 6 0.9,0.75 | smd 0.5 x 0.4: 2 -0.9,0; 5 0.9,0
QFP50P1600X1600X120-100N = smd 1.473 x 0.279: 1 -7.62,5.994; 2 -7.62,5.512; 3 -7.62,5.004; 4 -7.62,4.496; 5 -7.62,3.988; 6 -7.62,3.505; 7 -7.62,2.997; 8 -7.62,2.489; 9 -7.62,2.007; 10 -7.62,1.499; 11 -7.62,0.991; 12 -7.62,0.508; 13 -7.62,0; 14 -7.62,-0.508; 15 -7.62,-0.991; 16 -7.62,-1.499; 17 -7.62,-2.007; 18 -7.62,-2.489; 19 -7.62,-2.997; 20 -7.62,-3.505; 21 -7.62,-3.988; 22 -7.62,-4.496; 23 -7.62,-5.004; 24 -7.62,-5.512; 25 -7.62,-5.994; 51 7.62,-5.994; 52 7.62,-5.512; 53 7.62,-5.004; 54 7.62,-4.496; 55 7.62,-3.988; 56 7.62,-3.505; 57 7.62,-2.997; 58 7.62,-2.489; 59 7.62,-2.007; 60 7.62,-1.499; 61 7.62,-0.991; 62 7.62,-0.508; 63 7.62,0; 64 7.62,0.508; 65 7.62,0.991; 66 7.62,1.499; 67 7.62,2.007; 68 7.62,2.489; 69 7.62,2.997; 70 7.62,3.505; 71 7.62,3.988; 72 7.62,4.496; 73 7.62,5.004; 74 7.62,5.512; 75 7.62,5.994 | smd 0.279 x 1.473: 26 -5.994,-7.62; 27 -5.512,-7.62; 28 -5.004,-7.62; 29 -4.496,-7.62; 30 -3.988,-7.62; 31 -3.505,-7.62; 32 -2.997,-7.62; 33 -2.489,-7.62; 34 -2.007,-7.62; 35 -1.499,-7.62; 36 -0.991,-7.62; 37 -0.508,-7.62; 38 0,-7.62; 39 0.508,-7.62; 40 0.991,-7.62; 41 1.499,-7.62; 42 2.007,-7.62; 43 2.489,-7.62; 44 2.997,-7.62; 45 3.505,-7.62; 46 3.988,-7.62; 47 4.496,-7.62; 48 5.004,-7.62; 49 5.512,-7.62; 50 5.994,-7.62; 76 5.994,7.62; 77 5.512,7.62; 78 5.004,7.62; 79 4.496,7.62; 80 3.988,7.62; 81 3.505,7.62; 82 2.997,7.62; 83 2.489,7.62; 84 2.007,7.62; 85 1.499,7.62; 86 0.991,7.62; 87 0.508,7.62; 88 0,7.62; 89 -0.508,7.62; 90 -0.991,7.62; 91 -1.499,7.62; 92 -2.007,7.62; 93 -2.489,7.62; 94 -2.997,7.62; 95 -3.505,7.62; 96 -3.988,7.62; 97 -4.496,7.62; 98 -5.004,7.62; 99 -5.512,7.62; 100 -5.994,7.62
QFN50P500X500X80-29N = smd 1.01 x 0.27: 1 -2.36,1.5; 2 -2.36,1; 3 -2.36,0.5; 4 -2.36,0; 5 -2.36,-0.5; 6 -2.36,-1; 7 -2.36,-1.5; 15 2.36,-1.5; 16 2.36,-1; 17 2.36,-0.5; 18 2.36,0; 19 2.36,0.5; 20 2.36,1; 21 2.36,1.5 | smd 0.27 x 1.01: 8 -1.5,-2.36; 9 -1,-2.36; 10 -0.5,-2.36; 11 0,-2.36; 12 0.5,-2.36; 13 1,-2.36; 14 1.5,-2.36; 22 1.5,2.36; 23 1,2.36; 24 0.5,2.36; 25 0,2.36; 26 -0.5,2.36; 27 -1,2.36; 28 -1.5,2.36 | smd 3.25 x 3.25: 29 0,0
QFN50P250X300X100-15N = smd 0.6 x 0.25: 1 -1.15,0.75; 2 -1.15,0.25; 3 -1.15,-0.25; 4 -1.15,-0.75 | smd 0.25 x 0.6: 5 -0.725,-1.4; 6 -0.225,-1.4; 14 -0.225,1.4; 15 -0.725,1.4 | smd 0.85 x 0.7: 7-8 0.525,-1.4; 12-13 0.525,1.4 | smd 1.45 x 0.35: 9 0.775,-0.5; 11 0.775,0.5 | smd 1.8 x 0.35: 10 0.6,0
DFN10_3X3MM = smd 2.35 x 1.58: GND 0,0 | smd 0.25 x 0.8: P$1 -1,-1.5; P$2 -0.5,-1.5; P$3 0,-1.5; P$4 0.5,-1.5; P$5 1,-1.5; P$6 1,1.5; P$7 0.5,1.5; P$8 0,1.5; P$9 -0.5,1.5; P$10 -1,1.5
SOT95P280X145-5N = smd 1.27 x 0.635: 1 -1.255,0.95; 2 -1.255,0; 3 -1.255,-0.95; 4 1.255,-0.95; 5 1.255,0.95
IC_TPS2121RUXR = smd 1.05 x 0.4: 1 -0.675,0.35; 2 -0.675,-0.35; 7 0.675,-0.35; 8 0.675,0.35 | smd 0.2 x 0.6: 3 -0.75,-1.15; 4 -0.25,-1.15; 5 0.25,-1.15; 6 0.75,-1.15; 9 0.75,1.15; 10 0.25,1.15; 11 -0.25,1.15; 12 -0.75,1.15
SOT95P284X122-5N = smd 1.27 x 0.533: 1 -1.219,0.94; 2 -1.219,0; 3 -1.219,-0.94; 4 1.219,-0.94; 5 1.219,0.94
SOT96-1 = smd 0.6 x 1.3: 1 -1.905,-2.65; 2 -0.635,-2.65; 3 0.635,-2.65; 4 1.905,-2.65; 5 1.905,2.65; 6 0.635,2.65; 7 -0.635,2.65; 8 -1.905,2.65
SOIC127P1034X264-18N = smd 1.981 x 0.559: 1 -4.699,5.08; 2 -4.699,3.81; 3 -4.699,2.54; 4 -4.699,1.27; 5 -4.699,0; 6 -4.699,-1.27; 7 -4.699,-2.54; 8 -4.699,-3.81; 9 -4.699,-5.08; 10 4.699,-5.08; 11 4.699,-3.81; 12 4.699,-2.54; 13 4.699,-1.27; 14 4.699,0; 15 4.699,1.27; 16 4.699,2.54; 17 4.699,3.81; 18 4.699,5.08
JST-XH-02-PACKAGE-LONG-PAD = drill 1.016 long: 1 -1.27,0; 2 1.27,0
JST-XH-04-PACKAGE-LONG-PAD = drill 1.016 long: 1 -3.81,0; 2 -1.27,0; 3 1.27,0; 4 3.81,0
XTAL_ECS-160-20-3X-TR = smd 3.5 x 1.2: 1 -2.75,0; 2 2.75,0

### Placement (x,y rotation side)
C1  48.9,16 180 bottom
C2  49.15,6.73 0 top
C3  61.09,12.06 0 top
C4  58.04,16.13 180 top
C5  18.8,16.89 90 bottom
C7  33.53,46.23 90 bottom
C8  3.81,15.75 270 top
C9  30.73,1.78 90 top
C10  41.66,46.23 90 bottom
C12  24.26,9.65 270 top
C13  22.23,9.65 270 top
C14  25.78,13.46 90 top
C15  25.65,30.99 90 top
C16  46.74,29.97 180 top
C17  30.23,46.23 90 bottom
C18  21.84,46.23 90 bottom
C19  20.07,7.62 270 bottom
C20  22.1,7.62 270 bottom
C21  58.04,14.1 180 top
C22  19.05,5.84 270 top
D1  59.31,9.91 180 top
D2  59.31,8 180 top
D3  7.62,3.05 270 top
D5  4.06,39.37 0 top
D6  37.08,43.94 0 top
D7  10.92,3.05 270 top
D8  14.22,3.05 270 top
J1  30.99,11.43 90 top
J2  52.32,4.19 0 top
JP1  51.56,46.23 0 top
JP2  32.51,52.32 0 top
JP3  59.44,33.53 270 top
JP4  59.44,43.69 270 top
JP5  59.44,23.37 270 top
JP6  16.51,37.08 0 top
JP7  13.46,41.66 180 top
JP8  10.16,38.86 90 top
L1  8.13,17.27 0 top
L2  23.88,4.06 0 top
R1  55.63,8.38 270 top
R2  32.26,43.69 180 bottom
R3  8.38,8.89 180 bottom
R4  8.38,6.86 180 bottom
R5  12.7,36.7 270 top
R6  30.35,14.22 0 top
R7  39.62,28.45 90 bottom
R8  9.65,4.32 180 bottom
R9  27.81,13.46 90 top
R10  17.02,5.84 270 top
R11  16.76,16.89 90 bottom
R13  63.12,10.03 180 top
R14  63.12,8 180 top
R16  18.8,11.94 180 bottom
R17  15.75,11.94 180 bottom
R20  16.51,6.35 180 bottom
RN3  52.32,41.15 180 bottom
RN4  48.51,41.15 180 bottom
RN5  17.78,44.45 0 top
RN6  12.19,44.45 0 top
SW1  4.83,45.97 180 top
T1  12.19,47.5 180 top
T2  48.51,37.59 180 bottom
T3  52.32,37.59 180 bottom
T4  17.78,47.5 180 top
U1  35.31,32 180 top
U2  51.44,11.43 0 top
U3  27.3,9.4 270 top
U4  12.95,9.14 0 top
U5  13.59,16.89 0 top
U6  18.03,9.14 180 top
U7  61.59,14.61 180 top
U8  23.37,37.85 180 bottom
U9  32.26,32.77 180 bottom
X2  3.81,10.41 90 top
X6  16,27.69 90 top
X7  8.64,27.69 90 top
Y1  37.59,46.99 180 top
Y2  26.04,46.99 0 top

### Tracks (layer width: path | path; a pad name or v marks a point on that pad's centre or on a via)
3.3V
  Top 0.254: C4.1 59.47,15.54 U7.4 U7.5 | U7.5 59.32,13.66 C21.1 | U7.5 60.38,12.2 C3.1 | U7.5 59.55,12.84 56.27,12.84 53.53,15.59 48.45,15.59 47.27,14.41 47.27,10.52 48.99,10.52 U2.6
5V  (via drill 0.35)
  Top 0.152: 2.81,44.45 3.26,44 6.53,44 7.23,44.7 8.92,44.7 9.62,44 10.16,44 | RN6.1 10.16,44 | RN6.3 12.3,43.85 12.3,43.66 11.52,42.88 | 11.52,42.88 10.44,42.88 10.11,43.2 10.11,43.66 10.16,43.71 10.16,44 | 11.52,42.88 12.22,42.88 12.47,42.62 15.53,42.62 15.58,42.67 | RN5.1 15.58,42.67 | RN5.3 18.03,42.68 18.03,42.67 15.58,42.67 | U1.80 31.32,26.36 | 41.08,26.34 41.44,25.98 41.44,24.52 U1.100 | 42.09,30.37 42.79,30.37 U1.10 43.07,30.37 44.69,30.37 45.08,29.97 C16.2 45.61,30.25 | 42.09,30.37 41.08,29.35 41.08,26.34 | 42.09,30.37 38.81,33.65 U1.31 38.81,40.9 42.26,44.35 v42.31,44.35 | 31.32,26.36 31.32,30.08 28.52,32.88 27.8,32.88 U1.61 25.81,32.99 v25.78,33.02 25.78,31.97 C15.2 | v52.84,43.58 52.3,43.05 v52.3,42.54 | v47.6,42.16 v47.6,42.17 v48.77,42.17 49.8,43.2 v50.27,43.2 | 41.08,26.34 v41.05,26.36 31.32,26.36
  Top 0.254: 49.78,54.84 49.78,54.3 50.06,54.02 50.06,48.54 JP1.2 | 16.2,8.95 16.2,7.32 16.19,7.31 16.19,5.82 R10.2 16.89,4.87 16.89,3.05 8.5,3.05 D3.A | 59.44,19.05 59.44,18.92 U7.3 62.42,15.15 62.06,15.15 61.9,14.99 61.9,14.22 62.06,14.06 62.42,14.06 U7.1 63.97,12.51 R13.1 R14.1 63.88,7.91 63.88,7.37 63.08,7.37 62.88,7.17 57.69,7.17 R1.1
  Top 0.381: 7.37,23.88 X7.1 | X7.1 X6.1 | X7.1 6.6,25.91 6.6,36.83 6.51,36.93 5.62,36.93 5.42,37.13 5.42,38.01 2.46,40.97 D5.1 2.81,42.16 2.81,44.45 2.81,48.02 4,49.21 4.86,49.21 6.79,51.14 6.79,52 JP2.2 JP2.4 11.9,53.59 13,54.7 49.64,54.7 49.78,54.84 56.96,54.84 57.75,54.05 57.75,53.25 58.21,52.79 58.21,51.14 59.44,49.91 JP4.2 JP4.5 JP4.8 JP4.11 JP3.2 JP3.5 JP3.8 JP3.11 JP5.2 JP5.5 JP5.8 JP5.11 59.44,19.05 | C19.1 19.74,8.79 U6.1 U6.8 17.2,8.95 16.2,8.95 15.71,9.44 v15.71,10.54
  Bottom 0.152: RN3.1 51.72,41.87 51.72,41.94 51.85,42.08 51.93,42.08 52.3,42.45 v52.3,42.54 51.46,42.54 50.94,43.06 50.41,43.06 v50.27,43.2 | v52.84,43.58 52.88,43.54 58.32,43.54 JP4.8 | v42.31,44.35 45.06,41.6 RN4.1 47.6,41.64 v47.6,42.16 | RN4.3 v48.77,42.17 | U9.18 39.54,27.69 R7.1 40.86,26.36 v41.05,26.36 | U8.3 24.74,39.76 24.74,37 25.8,35.94 25.8,34.45 25.78,34.43 v25.78,33.02
  Bottom 0.254: C20.1 C19.1
  Bottom 0.381: X6.1 15.71,23.59 15.71,12.66 15.74,12.63 15.74,11.25 15.71,11.22 v15.71,10.54
  other vias: 20.07,8.47
5V_BATT  (via drill 0.35)
  Top 0.254: 15,15.79 U5.4 16.66,15.94 R11.1
  Top 0.381: 15.35,15.94 U5.4 16.38,14.4 16.38,9.53 16.41,9.49 U6.7
  Bottom 0.254: R11.1 C5.1
  other vias: 16.76,16.04
5V_JACK  (via drill 0.35)
  Top 0.254: U3.5 25.81,10.03 25.49,10.03 25.33,9.86 25.33,9.38 25.49,9.22 25.56,9.22 U3.7-8 25.83,8.8 C12.2 C13.2 21.76,9.27 21.34,9.27 | D7.A D8.A 14.17,3.98 v14.17,6.73 | 21.08,9 21.34,9.25 21.34,9.27 | 21.34,9.27 v21.34,11.94 v21.34,14.61
  Top 0.381: U4.P$2 U4.P$1 11.95,6.72 v11.94,6.7 | U3.7-8 25.78,9 | 21.08,9 20.48,9 20.15,9.34 18.87,9.34 U6.2
  Bottom 0.254: v11.94,6.7 12.7,7.46 13.21,7.46 13.56,7.11 13.79,7.11 v14.17,6.73 14.45,7.01 14.78,7.01 15.13,7.37 15.13,7.7 16.93,9.49 U6.2 | v21.34,14.61 27.52,14.61 R9.2 | R16.2 v21.34,11.94
  other vias: 18.71,9.49 27.81,14.31
AIN0
  Top 0.152: JP5.1 50.57,27.18 46.81,23.42 40.08,23.42 39.94,23.55 39.94,24.24 U1.97
AIN1
  Top 0.152: JP5.4 48.46,24.64 46.94,23.11 39.87,23.11 39.43,23.55 39.43,24.24 U1.96
AIN2
  Top 0.152: U1.95 38.92,24.27 38.92,23.55 40.13,22.35 56.64,22.35 JP5.7
AIN3
  Top 0.152: JP5.10 55.78,20.68 55.78,22.05 39.95,22.05 38.44,23.55 38.44,24.24 U1.94
BATT  (via drill 0.35)
  Top 0.381: L1.1 6.08,17.17 C8.2 X2.2 | U4.P$9 U4.P$10 11.95,11.16 v11.94,11.18
  Bottom 0.381: v11.94,11.18 11.43,11.68 10.92,11.68 X2.2
CANH  (via drill 0.35)
  Top 0.152: v21.08,33.78 18.54,33.78 JP6.1 13.17,37.08 R5.1 10.2,37.55 JP8.1
  Bottom 0.152: U8.7 21.99,34.45 21.32,33.78 v21.08,33.78
CANL  (via drill 0.35)
  Top 0.152: v22.61,33.78 21.87,33.78 21.31,34.34 20.53,34.34 JP6.2 17.78,37.22 15.82,39.17 12.45,39.17 | 12.45,39.17 11.12,39.17 JP8.2 | JP7.2 12.45,41.05 12.45,39.17
  Bottom 0.152: v22.61,33.78 22.61,33.8 23.12,34.32 23.13,34.32 23.26,34.45 U8.6
CS  (via drill 0.35)
  Top 0.152: v44.2,35.05 42.98,35.05 U1.19
  Bottom 0.152: v44.2,35.05 42.55,33.41 42.55,28.82 42.05,28.32 41.33,28.32 41.2,28.45 35.87,28.45 35.74,28.58 35.74,29.33 36.01,29.6 36.33,29.6 U9.16
DIN  (via drill 0.35)
  Top 0.152: T4.3 18.36,47.93 18.35,47.93 18.03,47.61 18.03,45.97 | 18.03,45.97 RN5.6 | 18.03,45.97 18.09,46.03 v18.09,46.18 | v6.86,41.66 6.51,41.31 D5.4 | v19.31,41.91 19.56,41.66 v26.92,41.66 | v27.43,39.12 27.43,38.25 U1.51
  Bottom 0.152: v18.09,46.18 16.51,46.18 | 16.51,46.18 13.94,46.18 13.59,46.53 11.28,46.53 9.05,44.31 9.05,42.88 8.92,42.75 7.95,42.75 v6.86,41.66 | v19.31,41.91 19.31,43.38 17.78,44.91 16.73,44.91 16.4,45.24 16.4,45.7 16.51,45.8 16.51,46.18 | v26.92,41.66 27.43,41.15 v27.43,39.12
DIN_LV
  Top 0.152: RN5.7 17.53,47.61 17.21,47.93 17.2,47.93 T4.4 18.7,50.06 18.8,50.06 18.95,50.06 20.09,51.2 20.09,51.46 20.67,52.05 20.78,52.05 21.08,52.35 JP2.12
DIO13  (via drill 0.35)
  Top 0.254: v40.65,40.88 40.89,40.64 41.07,40.64 41.3,40.41 U1.26
  Bottom 0.152: R2.1 34.21,40.88 v40.65,40.88
GND  (via drill 0.35)
  Top 0.152: U1.99 40.82,25.46 v40.83,25.47 | U1.81 31.94,24.52 31.94,25.21 32.07,25.35 32.21,25.35 v32.51,25.65 | v21.59,37.08 21.59,37.34 | U1.11 43,30.94 v44.7,30.94 | 44.7,29.46 v44.7,29.56 | U5.2 12.19,17.03 | U1.32 38.3,41.6 v38.35,41.66 | U4.P$5 13.98,7.62 v14.53,7.62 | v35.05,41.44 35.01,41.4 v32.77,41.4 | C19.2 19.78,7.06 19.78,7.34 19.12,7.99 U6.12
  Top 0.254: U2.3 50.94,11.93 U2.29 50.55,10.54 v50.55,10.41 | U3.6 26.29,9.62 26.55,9.89 U3.4 24.3,10.55 C12.1 | U7.2 v64.14,14.61
  Bottom 0.152: U8.8 21.59,35.32 v21.59,37.08 | v44.7,30.94 v44.7,29.56 | v14.53,7.62 14.48,7.62 | v38.35,41.66 35.27,41.66 v35.05,41.44
  other vias: 61.94,12.06 20.07,6.77
  pour Bottom: 0,3 arc90 3,0 43,0 arc90 44,1 44,19 arc-90 45,20 arc-90 46,19 46,1 arc90 47,0 62,0 arc90 65,3 65,53 arc90 62,56 3,56 arc90 0,53 0,37.5 arc90 1,36.5 4,36.5 arc-90 5,35.5 5,20.5 arc-90 4,19.5 1,19.5 arc90 0,18.5
  pour Top: 0,3 arc90 3,0 43,0 arc90 44,1 44,19 arc-90 45,20 arc-90 46,19 46,1 arc90 47,0 62,0 arc90 65,3 65,53 arc90 62,56 3,56 arc90 0,53 0,37.5 arc90 1,36.5 4,36.5 arc-90 5,35.5 5,20.5 arc-90 4,19.5 1,19.5 arc90 0,18.5
MISO  (via drill 0.35)
  Top 0.254: JP1.1 46.99,42.93 46.99,39.8 v44.74,37.55 43.69,36.5 U1.22
  Bottom 0.152: T2.6 49.09,37.16 49.08,37.16 48.76,37.48 RN4.6 | v44.74,37.55 42.25,35.06 42.25,28.95 41.92,28.62 41.46,28.62 41.13,28.95 41.13,29.41 39.04,31.5 U9.15
  Bottom 0.254: T2.6 48.49,36.84 47.97,36.31 45.98,36.31 v44.74,37.55
MISO_LV
  Bottom 0.152: RN4.7 48.26,37.48 47.95,37.16 47.94,37.16 T2.1 47.42,37.04 46.51,37.04 44.78,38.76 41.69,38.76 41.36,39.09 41.36,39.55 42.17,40.36 42.17,43.2 35.3,50.06 30.83,50.06 30.25,50.64 30.25,52.05 JP2.18
MOSI  (via drill 0.35)
  Top 0.152: v41.92,39.32 v41.91,39.32 | v41.71,36.24 41.91,36.24
  Top 0.254: U1.21 42.84,36.08 42.07,36.08 41.91,36.24 v41.91,39.32 v44.22,41.63 48.59,46 50.06,46 JP1.4
  Bottom 0.152: T2.3 47.61,40.67 RN4.8 45.15,40.7 v44.22,41.63 | U9.14 38.23,32.77 38.86,33.4 38.86,34.06 39.81,35 41.12,35 41.45,35.33 41.45,35.98 v41.71,36.24
MOSI_LV
  Bottom 0.152: T2.4 49.39,38.37 RN4.5 49.83,40.7 50.13,41 50.13,42.2 42.27,50.06 38.45,50.06 37.46,51.05 JP2.23
N$1  (via drill 0.35)
  Top 0.254: v9.91,2.03 10.78,2.03 D7.C
  Bottom 0.254: R8.6 9.91,3.32 v9.91,2.03
N$2  (via drill 0.35)
  Top 0.152: U2.5 48.08,10.93 v47.88,11.13 | v51.69,5.33 51.69,4.21 J2.2
  Bottom 0.152: v47.88,11.13 51.69,7.32 v51.69,5.33
N$3  (via drill 0.35)
  Top 0.152: U2.4 48.6,11.43 v48.09,11.94 | v52.7,5.35 52.32,4.96 J2.3
  Bottom 0.152: v48.09,11.94 52.7,7.32 v52.7,5.35
N$4
  Top 0.254: R1.2 55.49,7.4 51.61,7.4 50.52,8.49 50.52,8.98 U2.9
N$5
  Top 0.254: D1.A 62.14,9.91 R13.2
N$6
  Top 0.254: D2.A R14.2
N$7
  Top 0.254: J1.1B 30.73,5.08 C9.2 | R6.2 31.2,11.64 J1.1A
  Top 0.381: U3.12-13 30.88,8.87 30.99,8.76
  Top 0.66: J1.1A 30.99,8.76 J1.1B 30.99,4.83
N$8  (via drill 0.35)
  Top 0.254: v13.21,2.16 14.21,2.16 D8.C
  Bottom 0.254: R8.5 12.26,2.16 v13.21,2.16
N$9  (via drill 0.35)
  other vias: 7.37,13.59
N$10  (via drill 0.35)
  Top 0.152: U2.28 49.94,14.84 v49.91,14.86
  Bottom 0.152: v49.91,14.86 49.74,15.03 C1.2
N$11  (via drill 0.35)
  Top 0.254: v8.89,2.03 8.75,2.17 D3.C
  Bottom 0.254: R8.7 9.25,2.39 v8.89,2.03
N$12  (via drill 0.35)
  Top 0.152: v35.4,43.94 D6.A
  Bottom 0.152: R2.2 35.14,43.69 v35.4,43.94
N$13
  Top 0.381: U3.11 27.8,5.94 L2.2
N$14
  Top 0.381: U3.9 26.8,7.99 22.88,4.06 L2.1
N$15
  Top 0.254: U3.3 27.05,10.95 26.95,11.05 26.95,11.44 C14.1
N$16
  Top 0.381: U5.1 12.04,17.55 11.65,17.55 11.37,17.27 L1.2
N$17  (via drill 0.35)
  other vias: 8.89,13.72
N$18  (via drill 0.35)
  other vias: 10.41,9.14
N$19  (via drill 0.35)
  Top 0.254: U4.P$6 13.86,10.74 13.86,11.16 12.83,12.19 11.52,12.19 11.35,12.02 10.93,11.6 9.23,9.9 R3.2
  other vias: 9.23,8.89
N$20
  Top 0.254: U3.14 28.61,9.72 28.29,9.72 28.13,9.88 28.13,10.48 U3.1 28.05,10.94 28.64,11.53 28.64,13.36 R6.1
N$21  (via drill 0.35)
  Top 0.254: U4.P$8 12.95,10.58 12.92,10.61 12.92,11.09 12.23,11.78 11.69,11.78 11.33,11.43 11.33,8.96 R4.2
  other vias: 9.23,6.86
N$22  (via drill 0.35)
  other vias: 14.99,9.91
N$23  (via drill 0.35)
  other vias: 7.37,10.41
N$24  (via drill 0.35)
  other vias: 7.11,5.33
N$25  (via drill 0.35)
  other vias: 2.03,16.76
N$26  (via drill 0.35)
  Top 0.152: JP7.1 15.24,40.29 v15.28,40.29
  Top 0.254: R5.2 13.08,35.85 v13.21,35.98
  Bottom 0.152: v15.28,40.29 13.21,38.22 v13.21,35.98
N$27
  Bottom 0.152: R7.2 37.3,29.3 U9.17
N$28  (via drill 0.35)
  other vias: 42.16,9.14
N$29  (via drill 0.35)
  other vias: 3.81,18.03
N$30  (via drill 0.35)
  other vias: 11.43,14.48
N$31  (via drill 0.35)
  other vias: 56.01,16.13
N$32  (via drill 0.35)
  other vias: 25.15,28.96
N$33  (via drill 0.35)
  other vias: 42.93,8.38
N$34  (via drill 0.35)
  other vias: 42.16,7.62
N$35  (via drill 0.35)
  other vias: 56.01,14.1
N$36  (via drill 0.35)
  other vias: 19.05,3.68
N$37  (via drill 0.35)
  other vias: 17.91,3.68
N$38  (via drill 0.35)
  Top 0.254: U6.10 17.78,7.37 17.85,7.31 17.85,6.55 v18.05,6.35
  Bottom 0.254: v18.05,6.35 R20.2
N$39
  Top 0.254: C22.1 19.05,7.23 18.86,7.42 18.6,7.42 18.41,7.61 18.41,7.87 U6.11
N$40  (via drill 0.35)
  other vias: 20.19,3.68
N$41  (via drill 0.35)
  other vias: 20.19,2.67
N$42  (via drill 0.35)
  other vias: 19.05,2.67
N$43  (via drill 0.35)
  other vias: 17.91,2.67
N$44  (via drill 0.35)
  other vias: 17.91,1.65
N$45  (via drill 0.35)
  other vias: 19.05,1.65
N$46  (via drill 0.35)
  other vias: 20.19,1.65
N$47  (via drill 0.35)
  other vias: 24.26,12.19
N$48  (via drill 0.35)
  other vias: 24.26,13.08
N$49  (via drill 0.35)
  other vias: 24.26,13.97
N$50  (via drill 0.35)
  other vias: 22.35,13.97
N$51  (via drill 0.35)
  other vias: 22.35,13.08
N$52  (via drill 0.35)
  other vias: 22.35,12.19
N$53  (via drill 0.35)
  other vias: 63.25,12.06
N$54  (via drill 0.35)
  other vias: 14.86,13.46
N$55  (via drill 0.35)
  other vias: 13.97,13.46
N$56  (via drill 0.35)
  other vias: 14.86,14.35
N$57  (via drill 0.35)
  other vias: 13.97,14.35
N$58  (via drill 0.35)
  other vias: 30.23,43.94
N$59  (via drill 0.35)
  other vias: 22.23,43.94
N$60  (via drill 0.35)
  other vias: 23.24,43.94
N$61  (via drill 0.35)
  other vias: 24.26,43.94
N$62  (via drill 0.35)
  other vias: 28.19,43.94
N$63  (via drill 0.35)
  other vias: 27.18,43.94
N$64  (via drill 0.35)
  other vias: 43.05,45.47
N$65  (via drill 0.35)
  other vias: 43.05,46.35
N$66  (via drill 0.35)
  other vias: 43.05,47.24
N$67  (via drill 0.35)
  other vias: 32.13,45.47
N$68  (via drill 0.35)
  other vias: 32.13,46.35
N$69  (via drill 0.35)
  other vias: 32.13,47.24
OSC1  (via drill 0.35)
  Top 0.152: v23.11,47.24 23.11,47.16 Y2.1 24.64,45.64 v24.64,44.96
  Bottom 0.152: U9.8 28.32,37.34 28.64,37.34 28.78,37.47 28.78,40.82 v24.64,44.96 | C18.2 24.08,47.11 24.22,47.24 v23.11,47.24
OSC2  (via drill 0.35)
  Top 0.152: v28.83,46.99 28.81,47.01 Y2.2 28.79,45 v28.83,44.96
  Bottom 0.152: U9.7 28.78,35.31 28.78,37.04 29.16,37.42 29.16,44.63 v28.83,44.96 | v28.83,46.99 28.92,47.08 C17.2
PG  (via drill 0.35)
  Top 0.254: U6.3 18.78,10.78 v18.92,10.92 | U3.2 v27.56,11.3 27.56,12.36 R9.1
  Bottom 0.254: v18.92,10.92 19.11,11.11 20.26,11.11 20.46,11.3 v27.56,11.3
PI3V3  (via drill 0.35)
  Top 0.152: v10.57,44.56 10.56,44.57 10.56,46.82 10.96,47.23 11.02,47.23 T1.5 | v18.59,43.18 18.59,43.93 RN5.4 | v18.4,48.98 18.65,48.73 19.01,48.73 19.16,48.58 19.16,47.92 19.01,47.77 18.95,47.77 T4.2 | v16.76,48.98 16.76,48.94 16.4,48.58 16.4,47.86 | v12.7,43.18 15.65,43.18 15.9,43.43 v15.9,43.79 15.38,44.3 15.38,47.08 16.17,47.86 16.4,47.86 | v11.95,48.76 11.95,48.64 12.68,48.64 12.76,48.73 13.42,48.73 13.57,48.58 13.57,47.92 13.15,47.5 T1.2 | T1.5 11.02,47.77 10.96,47.77 10.81,47.92 10.81,48.78 v10.74,48.86 8.54,51.05 JP2.1 | v54.94,42.21 54.5,41.78 v54.5,40.81 | v46.74,37.59 45.47,36.32 v45.47,35.78 | v49.73,43.89 49.35,43.89 v48.36,42.9 | 11.23,47.5 T1.5 | 16.4,47.86 16.76,47.5 T4.5 | v17.02,43.23 17.53,43.74 RN5.2
  Top 0.254: 10.58,48.86 v10.74,48.86 | v18.59,43.18 21.06,43.18 21.95,42.29 34.34,42.29 v34.54,42.09 | v41.62,41.4 42.32,41.4 v42.73,41
  Bottom 0.152: 10.67,44.46 v10.57,44.56 11.7,43.43 12.45,43.43 v12.7,43.18 | v18.59,43.18 17.07,43.18 v17.02,43.23 16.97,43.18 16.51,43.18 v15.9,43.79 | v18.4,48.98 v16.76,48.98 | v11.95,48.76 10.84,48.76 v10.74,48.86 | 48.54,42.72 48.21,42.4 48.21,41.94 48.26,41.88 RN4.2 | 48.54,42.72 49,42.72 49.32,42.4 49.32,41.66 RN4.4 | RN3.4 53.68,42.08 | 53.68,42.08 53.81,42.21 v54.94,42.21 | v54.5,40.81 54.5,38.81 53.55,37.86 53.49,37.86 T3.5 52.98,37.59 51.75,36.36 51.09,36.36 | 51.09,36.36 50.26,35.52 45.72,35.52 v45.47,35.78 | 51.09,36.36 49.87,37.59 T2.5 | 53.68,42.08 52.73,43.03 52.6,43.03 51.74,43.89 v49.73,43.89 | v48.36,42.9 48.54,42.72 | v42.73,41 43.33,41 v46.74,37.59 T2.2
  Bottom 0.254: v34.54,42.09 37.93,42.09 38.1,42.26 40.76,42.26 v41.62,41.4
PR1  (via drill 0.35)
  Top 0.254: v17.27,10.92 17.28,10.91 U6.6
  Bottom 0.254: R17.2 16.6,11.6 v17.27,10.92 17.95,11.6 R16.1
PRX
  Bottom 0.152: 16.08,25.38 16.03,25.43 14.83,25.43 14.25,26.01 14.25,26.83 16,28.58 X6.3
  Bottom 0.254: 16.08,25.38 18.46,25.38 20.32,27.23 20.32,47.91 19.58,48.65 19.58,51.48 18.54,52.53 JP2.10
PSCL
  Top 0.152: T1.4 11.29,48.88 JP2.5
PSDA
  Top 0.152: T1.1 13.41,47.07 13.43,47.07 14.45,48.1 14.45,51.46 13.87,52.05 13.05,52.05 12.06,51.05 JP2.3
PTX
  Bottom 0.254: JP2.8 16,52.53 17.04,51.48 17.04,50.62 16,49.58 16,48.12 17.33,46.78 18.84,46.78 19.91,45.72 19.91,30.33 X6.2
PWM0
  Top 0.152: JP3.10 52.68,29.72 50.79,27.83 49.67,27.83 47.6,25.76 43.18,25.76 U1.1 43.04,26.12
PWM1
  Top 0.152: JP3.7 54.79,32.26 50.66,28.13 43.04,28.13 U1.5
PWM2
  Top 0.152: JP3.4 50.6,28.5 U1.6
PWM3
  Top 0.152: JP3.1 48.56,29.01 U1.7
PWM4
  Top 0.152: JP4.10 50.01,32.99 U1.15
PWM5
  Top 0.152: JP4.7 47.98,33.5 U1.16
PWM6
  Top 0.152: JP4.4 45.95,34.01 U1.17
PWM7
  Top 0.152: JP4.1 55.09,45.7 55.09,44.55 45.04,34.49 U1.18
PWR_ST  (via drill 0.35)
  Top 0.254: U6.9 17.28,6.96 R10.1 17.44,6.27 17.44,6.1 17.8,5.74 17.97,5.74 18.05,5.66 v18.05,5.32 | v23.37,9.66 23.37,17.45 29.29,23.37 32.06,23.37 32.22,23.53 32.22,24.3 U1.82
  Bottom 0.254: v23.37,9.66 22.88,9.16 22.88,7.8 22.71,7.64 21.36,7.64 20.84,7.13 20.84,6.1 20.06,5.32 v18.05,5.32
RESET  (via drill 0.35)
  Top 0.152: 16.91,45.47 16.91,46.72 T4.6 16.43,46.75 v16.26,46.92 | 16.91,45.47 RN5.8 | 16.91,45.47 v16.96,45.47 | v41.69,29.18 41.95,28.92 41.95,27.99 v41.71,27.76 | v39.42,33.83 39.42,39.5 U1.30 | v19.24,45.51 21.84,42.9 v34.27,42.9 | v37.8,42.88 38.1,43.18 v39.22,43.18 | v42,25.19 41.92,25.11 v41.92,23.98 | 39.38,40.48 v41.62,42.71 43.86,44.96
  Top 0.254: 39.38,40.48 39.38,39.71 U1.30 | 43.86,44.96 44.63,44.96 46.08,46.41 49.9,46.41 50.52,47.03 50.52,47.93 51.13,48.54 51.99,48.54 52.6,47.93 52.6,46.46 JP1.5
  Bottom 0.152: v41.69,29.18 41.69,31.56 v39.42,33.83 | v19.24,45.51 19.19,45.47 v16.96,45.47 | v34.27,42.9 37.77,42.9 v37.8,42.88 | v39.22,43.18 41.15,43.18 v41.62,42.71 | v16.26,46.92 14.96,48.22 12.21,48.22 12.18,48.2 11.72,48.2 11.69,48.22 SW1.3 | v41.71,27.76 41.71,25.48 v42,25.19 | v41.92,23.98 41.92,23.47 41.95,23.5 46.1,23.5 46.35,23.5 46.35,17.69 C1.1
RX0  (via drill 0.35)
  Top 0.152: v47.22,26.31 47.04,26.49 U1.2 | U2.26 50.94,14.57 v50.9,14.6
  Bottom 0.152: 51.01,22.53 50.9,22.63 | v47.22,26.31 50.8,22.73 50.9,22.63 | v50.9,14.6 50.9,22.63
RXCAN
  Bottom 0.152: U9.2 26.8,29.72 26.47,29.72 26.34,29.85 26.34,39.43 U8.4
RXLED
  Top 0.254: D2.C 55,11.43 U2.18
SCK  (via drill 0.35)
  Top 0.152: v40.89,35.56 42.88,35.56 U1.20
  Top 0.254: U1.20 42.99,35.57 43.78,35.57 v50.71,42.51 51.56,43.36 JP1.3
  Bottom 0.152: T3.3 51.42,40.67 RN3.8 51.45,40.76 50.96,41.25 50.96,42.26 v50.71,42.51 | v40.89,35.56 38.48,35.56 38.18,35.26 38.18,34.93 38.04,34.8 37.72,34.8 U9.13
SCK_LV
  Bottom 0.152: T3.4 53.2,38.37 RN3.5 53.64,40.7 53.94,41 53.94,41.66 | 53.94,41.66 53.94,41.69 | JP2.24 37.46,53.59 38.45,52.6 53.95,52.6 55.09,51.46 55.09,50.88 58.32,47.66 58.32,47.03 58.97,46.38 59.59,46.38 60.55,45.42 60.55,41.95 59.9,41.3 56.43,41.3 56.08,41.66 53.94,41.66
SCL  (via drill 0.35)
  Top 0.152: RN6.6 12.58,45.03 12.58,45.97 | T1.3 12.77,47.93 12.76,47.93 12.58,47.74 12.58,45.97 | 12.58,45.97 v12.54,45.97 | U1.43 32.68,39.76 32.68,40.45 32.24,40.89 v18.8,40.89
  Bottom 0.152: v12.54,45.97 13.72,45.97 13.72,45.39 13.77,45.34 13.77,39.56 | 13.77,39.56 12.25,38.04 12.25,28.84 12.06,28.65 10.87,28.65 X7.2 | 13.77,39.56 15.1,40.89 v18.8,40.89
SDA  (via drill 0.35)
  Top 0.152: T1.6 11.29,45.97 | 11.29,45.97 11.29,44.92 RN6.8 | 11.29,45.97 11.25,45.93 v11.25,45.72 | v13.15,39.73 28.22,39.73 29.08,40.59 32.03,40.59 32.17,40.45 32.17,39.76 U1.44
  Bottom 0.152: v11.25,45.72 11.76,45.21 13.46,45.21 13.46,43.69 13.22,43.45 13.26,43.41 13.26,39.62 | X7.3 11.94,28.96 11.94,38.16 13.26,39.48 13.26,39.62 | 13.26,39.62 v13.15,39.73
STAT1  (via drill 0.35)
  Top 0.254: U4.P$3 v12.95,6.86
  Bottom 0.254: v12.95,6.86 12.95,5.68 10.95,5.68 R8.4
STAT2  (via drill 0.35)
  Top 0.254: 13.56,7.11 13.56,6.61 13.05,6.1 v10.41,6.1 | U4.P$4 13.45,7.22 13.56,7.11 | 13.57,7.11 13.56,7.11
  Bottom 0.254: v10.41,6.1 10.05,5.73 R8.3
TX0  (via drill 0.35)
  Top 0.152: U1.3 43.04,27.11 47.56,27.11 v47.61,27.06 | v51.71,14.78 51.46,14.52 51.46,14.37 51.44,14.35 U2.25
  Bottom 0.152: v47.61,27.06 51.82,22.86 51.82,14.88 v51.71,14.78
TXCAN
  Bottom 0.152: U8.1 22.2,39.76 22.2,39.11 24.74,36.57 24.74,30.18 26.47,28.45 26.8,28.45 U9.1
TXLED
  Top 0.254: U2.19 53.88,11.84 55.73,11.84 57.67,9.91 D1.C
UC_RST
  Top 0.152: RN5.5 18.68,44.92 T4.1 19,47.07 19.01,47.07 19.46,47.52 19.46,48.7 19.46,48.71 19.46,50.14 20.37,51.05 JP2.11
V_USB
  Top 0.254: J2.1 51.02,5.71 C2.2 50,9.01 U2.8 U2.7
XTAL1  (via drill 0.35)
  Top 0.152: U1.34 37.17,39.76 37.17,40.45 34.84,42.79 Y1.2 34.5,46.65
  Bottom 0.152: C7.2 33.62,46.99 Y1.2
  other vias: 34.84,46.99
XTAL2  (via drill 0.35)
  Top 0.152: U1.33 37.68,39.74 37.68,41.92 38.23,42.47 39.51,42.47 40.34,43.3 Y1.1 40.68,46.65 41.31,46.65
  Bottom 0.152: C10.2 41.57,46.99 Y1.1
  other vias: 40.34,46.99

### Text on the board
tSilk: 5V MOSI GND | PWM7 | > | RESET | DIO13 | MISO SCK RESET | TERM | ICSP | CAN | H L | H L | I2C | pSerial | PWM0 | ArgoHAT v0.2B | AIN0 | +5 TX RX GND | +5 SCL SDA GND | AIN3 | For use with / Raspberry Pi-Compatible / headers or stand-alone | S +5V GND | Designed 06/19 / Florida Tech, OEMS / Underwater Tech Lab | VIN: 2-16V / Max: 2A | TX | < | Sec. Power: / 1S LiPo ONLY | < | + - | RX | uSerial | POW | DONE | CHRG